# Altium project MU-RK3576J-MB.PrjPCB (part 1 of 13)
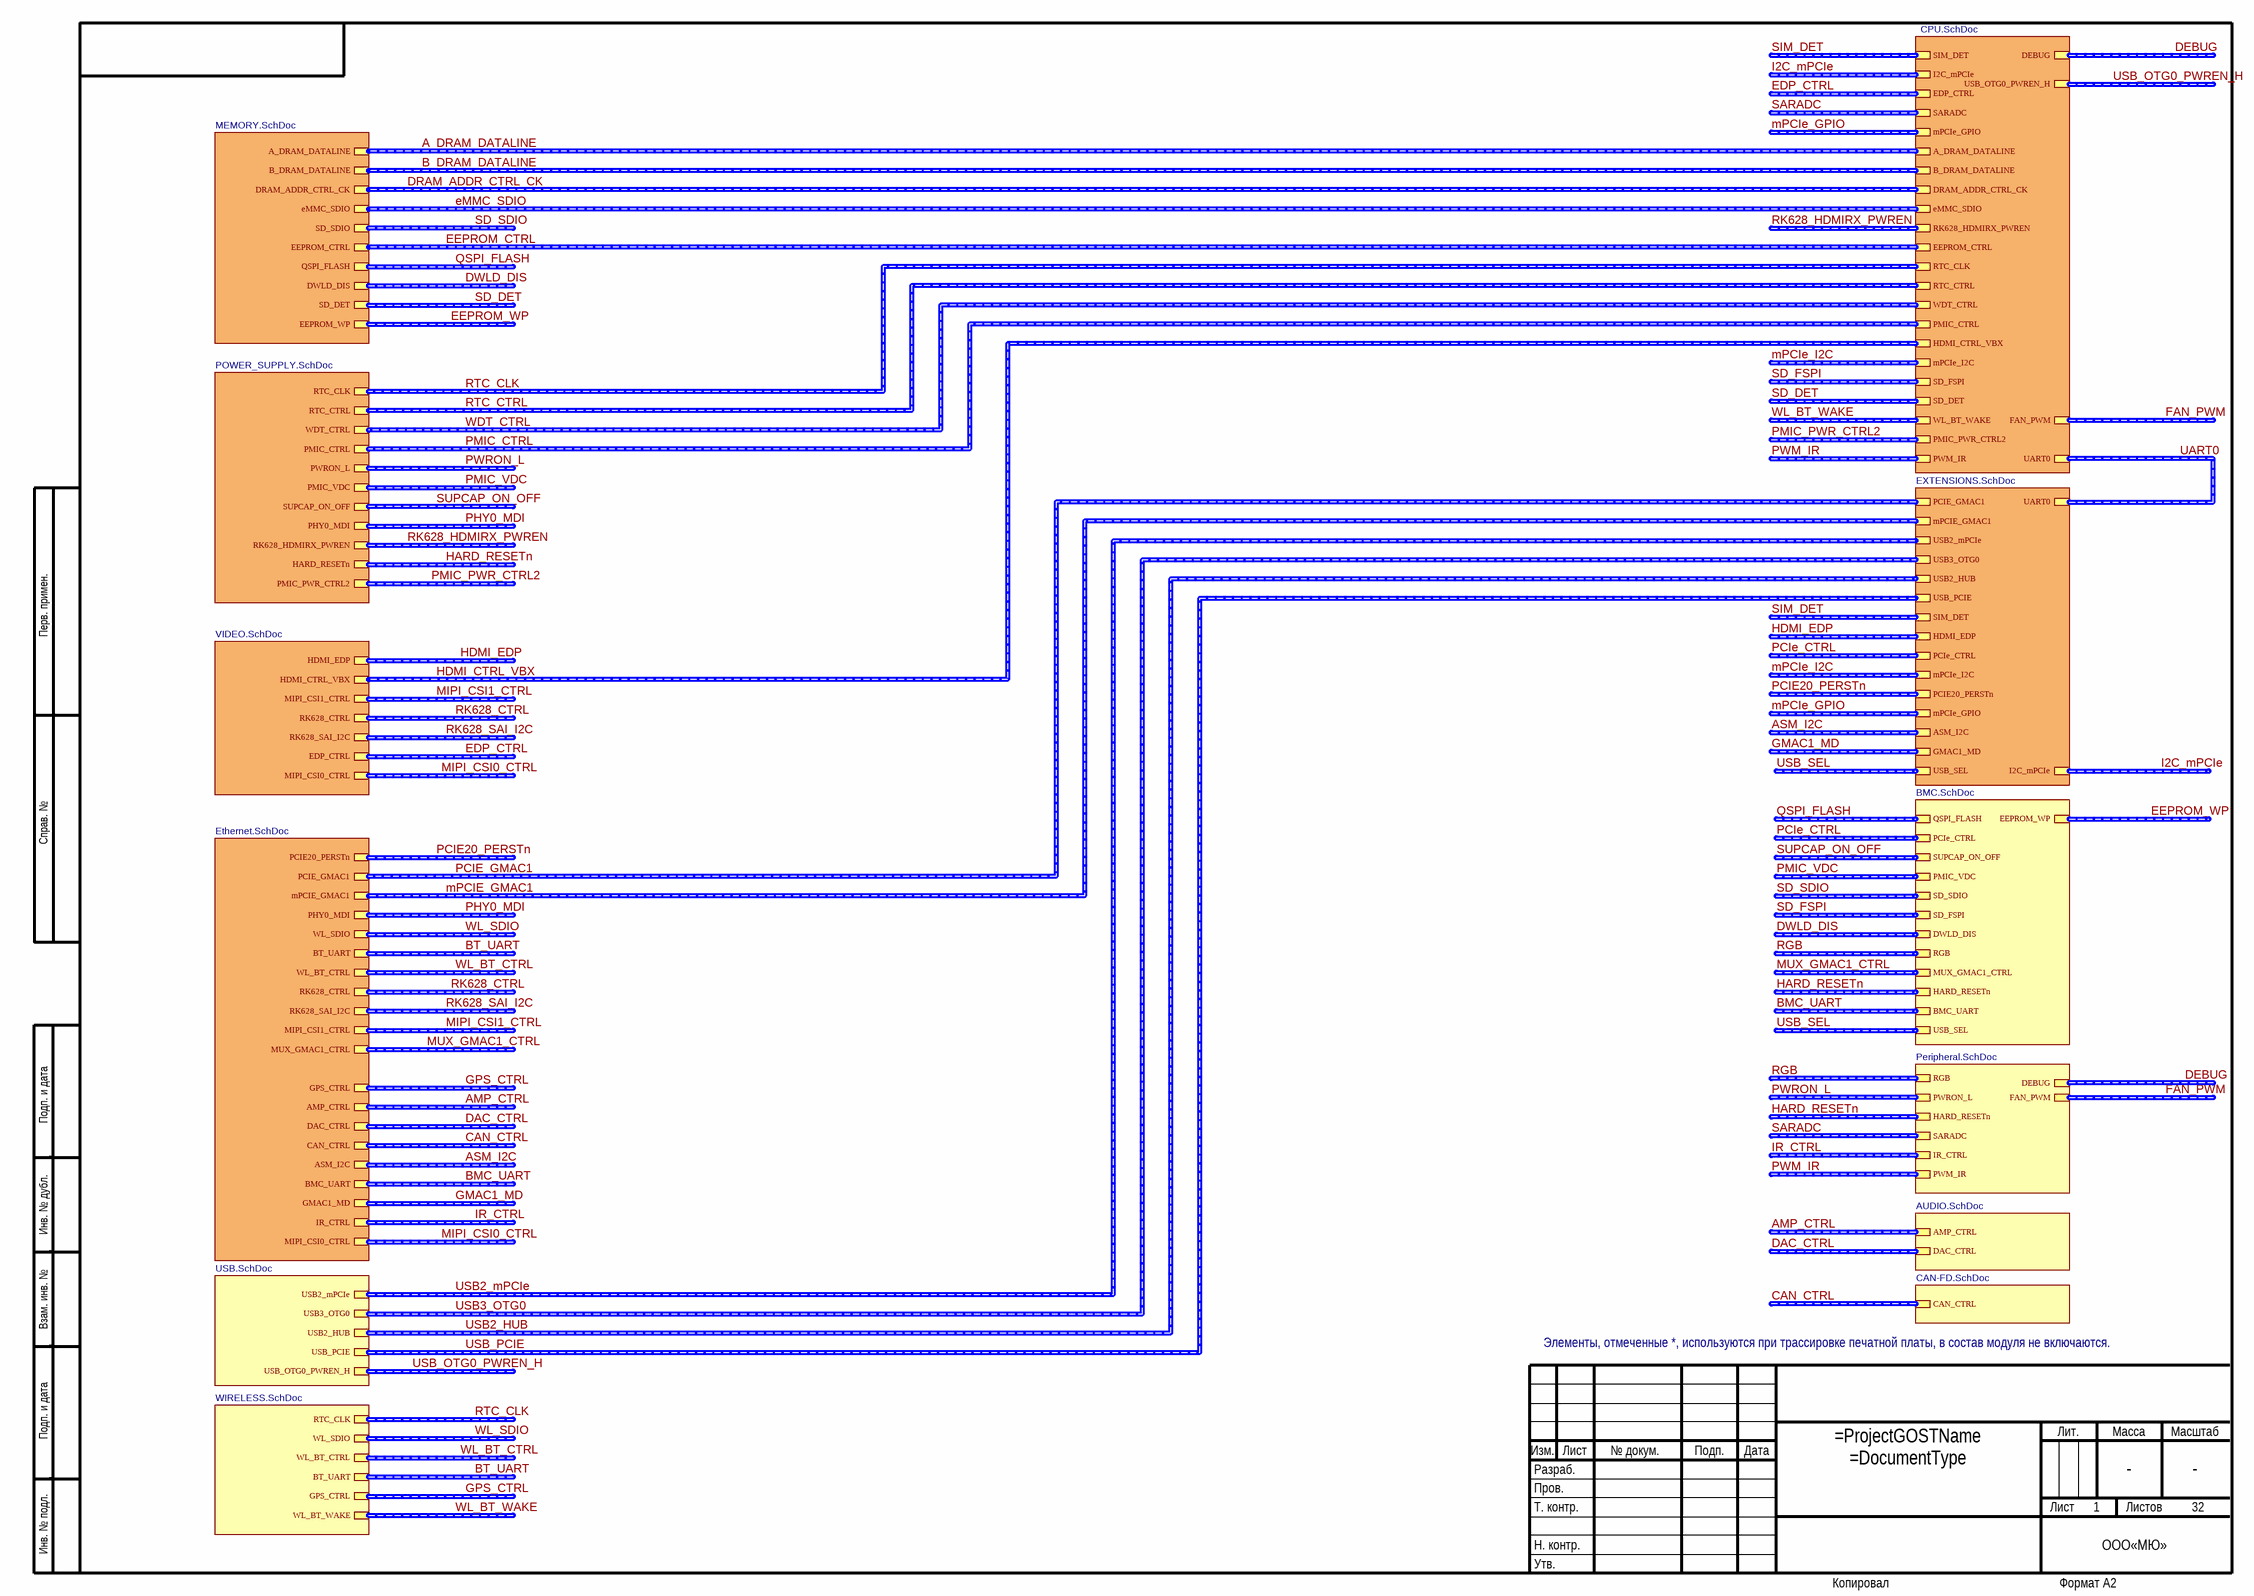
[diagram p0: Parent_sheet.SchDoc]
DecimalNumber: ЮРТН.466256.002; ProjectGOSTOrganization: «МЮ»; ProjectGOSTPCBName: Модуль процесорный; ProjectGOSTPCBNumber: АНПБ.687263.002; ProjectGOSTPCBWeight: 15 г; ProjectRevisionCode: C2D1; Вид_документа: Файл проекта печатной платы; Вид_документа_PCB: Файл печатной платы; Вид_документа_SCH: Схема электрическая принципиальная; Децимальный номер печатного узла: ЮРТН.466256.002; Код_документа_SCH: Э3; Код типа схемы: Э3; Наименование: Модуль процессорный; Наименование1: MU-RK3576J-MB; Наименование_PCB: Плата печатная; Обозначение: ЮРТН.466256.002; Обозначение_Код: ЮРТН.466256.002; Папка для сохранения графической документации: Документация; Папка для сохранения текстовой документации: Документация; Проект: ЮРТН.466256.002; Раздел: Документация; Раздел_PCB: Документация; Раздел_SCH: Документация; Разработал: SGDG; Тип документа: Схема электрическая принципиальная; Формат_PCB: А3
32 sheets, 1305 parts. Net scope: hierarchical (ports join the sheet entries above them; power ports are global).
Board file: MU-RK3576J-MB.PcbDoc
Sheets:
  Parent_sheet.SchDoc
    POWER_SUPPLY = POWER_SUPPLY.SchDoc
      PWR_DC_IN = PWR_DC_IN.SchDoc
      PWR_MAIN = PWR_MAIN.SchDoc
      PWR_PMIC = PWR_PMIC.SchDoc
      PWR_CPU = PWR_CPU.SchDoc
      PWR_PoE_PD_1000BASE-T = PWR_PoE_PD_1000BASE-T.SchDoc
      PWR_CORE = PWR_CORE.SchDoc
    CPU = CPU.SchDoc
      CPU_LPDDR4 = CPU_LPDDR4.SchDoc
      CPU_GPIO = CPU_GPIO.SchDoc
    MEMORY = MEMORY.SchDoc
      IC_LPDDR4 = IC_LPDDR4.SchDoc
      Flash_eMMC_MicroSD = Flash_eMMC_MicroSD.SchDoc
    VIDEO = VIDEO.SchDoc
      HDMI = HDMI.SchDoc
      CPU_MIPI_DSI_CSI = CPU_MIPI_DSI_CSI.SchDoc
      V-by-One.Sch = V-by-One.SchDoc
      LVDS_eDP = LVDS_eDP.SchDoc
      MIPI_x2CSI = MIPI_x2CSI.SchDoc
    EXTENSIONS = EXTENSIONS.SchDoc
      INT_mPCIeX2_SIM = INT_mPCIeX2_SIM.SchDoc
      CPU_PCIE_USB_HDMI_EXT_PCIEX2_mPCIeX2 = CPU_PCIE_USB_HDMI_EXT_PCIEX2_mPCIeX2.SchDoc
    USB = USB.SchDoc
    AUDIO = AUDIO.SchDoc
    BMC = BMC.SchDoc
    WIRELESS = WIRELESS.SchDoc
    Ethernet = Ethernet.SchDoc
      RGMII0_ETH_PHY = RGMII0_ETH_PHY.SchDoc
      CPU_ETH_RGMII1_SW = CPU_ETH_RGMII1_SW.SchDoc
    Peripheral = Peripheral.SchDoc
    CAN-FD = CAN-FD.SchDoc

## Sheet Parent_sheet.SchDoc
size 594 x 420 mm; SheetNumber: 1; SheetTotal: 32; Scale: -; DocumentType: Схема электрическая принципиальная; DocumentGOSTLIt1: ㅤ; DocumentGOSTLIt2: ㅤ; DocumentGOSTLIt3: ㅤ; DocumentGOSTNote: Элементы, отмеченные *, используются при трассировке печатной платы, в состав модуля не включаются.; DocumentTypeShort: Э3; DocumentInvertoryNumber: ㅤ

### Sub-sheets
AUDIO = AUDIO.SchDoc: AMP_CTRL (harness AMP_CTRL), DAC_CTRL (harness DAC_CTRL)
BMC = BMC.SchDoc: QSPI_FLASH (harness QSPI_FLASH), PCIe_CTRL (harness PCIe_CTRL), SUPCAP_ON_OFF (harness SUPCAP_ON_OFF), PMIC_VDC (harness PMIC_VDC), SD_SDIO (harness SD_SDIO), SD_FSPI (harness SD_FSPI), DWLD_DIS (harness DWLD_DIS), RGB (harness RGB), MUX_GMAC1_CTRL (harness MUX_GMAC1_CTRL), HARD_RESETn (harness HARD_RESETn), BMC_UART (harness BMC_UART), USB_SEL (harness USB_SEL), EEPROM_WP (harness EEPROM_WP)
CAN-FD = CAN-FD.SchDoc: CAN_CTRL (harness CAN_CTRL)
CPU = CPU.SchDoc: A_DRAM_DATALINE, B_DRAM_DATALINE, DRAM_ADDR_CTRL_CK, HDMI_CTRL_VBX, WDT_CTRL, RTC_CLK, RTC_CTRL, eMMC_SDIO, PMIC_CTRL, EEPROM_CTRL, SD_FSPI, SD_DET, WL_BT_WAKE, EDP_CTRL, SARADC, mPCIe_GPIO, RK628_HDMIRX_PWREN, SIM_DET, mPCIe_I2C, PMIC_PWR_CTRL2, PWM_IR, I2C_mPCIe, DEBUG, UART0, FAN_PWM, USB_OTG0_PWREN_H
Ethernet = Ethernet.SchDoc: PCIE_GMAC1, mPCIE_GMAC1, PHY0_MDI, WL_SDIO, BT_UART, WL_BT_CTRL, RK628_SAI_I2C, MIPI_CSI1_CTRL, MUX_GMAC1_CTRL, RK628_CTRL, GPS_CTRL, AMP_CTRL, DAC_CTRL, CAN_CTRL, ASM_I2C, BMC_UART, GMAC1_MD, PCIE20_PERSTn, IR_CTRL, MIPI_CSI0_CTRL
EXTENSIONS = EXTENSIONS.SchDoc: mPCIe_GPIO, SIM_DET, mPCIe_I2C, PCIE_GMAC1, mPCIE_GMAC1, USB3_OTG0, USB2_HUB, USB_PCIE, PCIe_CTRL, USB2_mPCIe, HDMI_EDP, ASM_I2C, GMAC1_MD, PCIE20_PERSTn, USB_SEL, I2C_mPCIe, UART0
MEMORY = MEMORY.SchDoc: A_DRAM_DATALINE, B_DRAM_DATALINE, DRAM_ADDR_CTRL_CK, eMMC_SDIO, SD_SDIO, EEPROM_CTRL, DWLD_DIS, SD_DET, QSPI_FLASH, EEPROM_WP
Peripheral = Peripheral.SchDoc: RGB (harness RGB), PWRON_L (harness PWRON_L), SARADC (harness SARADC), HARD_RESETn (harness HARD_RESETn), IR_CTRL (harness IR_CTRL), PWM_IR (harness PWM0_IR), DEBUG (harness DEBUG), FAN_PWM (harness FAN_PWM)
POWER_SUPPLY = POWER_SUPPLY.SchDoc: SUPCAP_ON_OFF, RTC_CLK, RTC_CTRL, WDT_CTRL, PHY0_MDI, PMIC_CTRL, PWRON_L, PMIC_VDC, HARD_RESETn, PMIC_PWR_CTRL2, RK628_HDMIRX_PWREN
USB = USB.SchDoc: USB2_mPCIe (harness USB2_mPCIe), USB3_OTG0 (harness USB3_OTG0), USB2_HUB (harness USB2_HUB), USB_PCIE (harness USB_PCIE), USB_OTG0_PWREN_H (harness USB_OTG0_PWREN_H)
VIDEO = VIDEO.SchDoc: HDMI_CTRL_VBX, MIPI_CSI1_CTRL, HDMI_EDP, RK628_SAI_I2C, EDP_CTRL, RK628_CTRL, MIPI_CSI0_CTRL
WIRELESS = WIRELESS.SchDoc: WL_SDIO (harness WL_SDIO), WL_BT_CTRL (harness WL_BT_CTRL), RTC_CLK (harness RTC_CLK), BT_UART (harness BT_UART), GPS_CTRL (harness GPS_CTRL), WL_BT_WAKE (harness WL_BT_WAKE)

### Buses and harness runs
harness A_DRAM_DATALINE = sheet CPU/A_DRAM_DATALINE = sheet MEMORY/A_DRAM_DATALINE
harness AMP_CTRL = sheet AUDIO/AMP_CTRL
harness AMP_CTRL = sheet Ethernet/AMP_CTRL
harness ASM_I2C = sheet Ethernet/ASM_I2C
harness ASM_I2C = sheet EXTENSIONS/ASM_I2C
harness B_DRAM_DATALINE = sheet CPU/B_DRAM_DATALINE = sheet MEMORY/B_DRAM_DATALINE
harness BMC_UART = sheet BMC/BMC_UART
harness BMC_UART = sheet Ethernet/BMC_UART
harness BT_UART = sheet Ethernet/BT_UART
harness BT_UART = sheet WIRELESS/BT_UART
harness CAN_CTRL = sheet CAN-FD/CAN_CTRL
harness CAN_CTRL = sheet Ethernet/CAN_CTRL
harness DAC_CTRL = sheet AUDIO/DAC_CTRL
harness DAC_CTRL = sheet Ethernet/DAC_CTRL
harness DEBUG = sheet CPU/DEBUG
harness DEBUG = sheet Peripheral/DEBUG
harness DRAM_ADDR_CTRL_CK = sheet CPU/DRAM_ADDR_CTRL_CK = sheet MEMORY/DRAM_ADDR_CTRL_CK
harness DWLD_DIS = sheet BMC/DWLD_DIS
harness DWLD_DIS = sheet MEMORY/DWLD_DIS
harness EDP_CTRL = sheet CPU/EDP_CTRL
harness EDP_CTRL = sheet VIDEO/EDP_CTRL
harness EEPROM_CTRL = sheet CPU/EEPROM_CTRL = sheet MEMORY/EEPROM_CTRL
harness EEPROM_WP = sheet BMC/EEPROM_WP
harness EEPROM_WP = sheet MEMORY/EEPROM_WP
harness eMMC_SDIO = sheet CPU/eMMC_SDIO = sheet MEMORY/eMMC_SDIO
harness FAN_PWM = sheet CPU/FAN_PWM
harness FAN_PWM = sheet Peripheral/FAN_PWM
harness GMAC1_MD = sheet Ethernet/GMAC1_MD
harness GMAC1_MD = sheet EXTENSIONS/GMAC1_MD
harness GPS_CTRL = sheet Ethernet/GPS_CTRL
harness GPS_CTRL = sheet WIRELESS/GPS_CTRL
harness HARD_RESETn = sheet BMC/HARD_RESETn
harness HARD_RESETn = sheet Peripheral/HARD_RESETn
harness HARD_RESETn = sheet POWER_SUPPLY/HARD_RESETn
harness HDMI_CTRL_VBX = sheet CPU/HDMI_CTRL_VBX = sheet VIDEO/HDMI_CTRL_VBX
harness HDMI_EDP = sheet EXTENSIONS/HDMI_EDP
harness HDMI_EDP = sheet VIDEO/HDMI_EDP
harness I2C_mPCIe = sheet CPU/I2C_mPCIe
harness I2C_mPCIe = sheet EXTENSIONS/I2C_mPCIe
harness IR_CTRL = sheet Ethernet/IR_CTRL
harness IR_CTRL = sheet Peripheral/IR_CTRL
harness MIPI_CSI0_CTRL = sheet Ethernet/MIPI_CSI0_CTRL
harness MIPI_CSI0_CTRL = sheet VIDEO/MIPI_CSI0_CTRL
harness MIPI_CSI1_CTRL = sheet Ethernet/MIPI_CSI1_CTRL
harness MIPI_CSI1_CTRL = sheet VIDEO/MIPI_CSI1_CTRL
harness mPCIE_GMAC1 = sheet Ethernet/mPCIE_GMAC1 = sheet EXTENSIONS/mPCIE_GMAC1
harness mPCIe_GPIO = sheet CPU/mPCIe_GPIO
harness mPCIe_GPIO = sheet EXTENSIONS/mPCIe_GPIO
harness mPCIe_I2C = sheet CPU/mPCIe_I2C
harness mPCIe_I2C = sheet EXTENSIONS/mPCIe_I2C
harness MUX_GMAC1_CTRL = sheet BMC/MUX_GMAC1_CTRL
harness MUX_GMAC1_CTRL = sheet Ethernet/MUX_GMAC1_CTRL
harness PCIE20_PERSTn = sheet Ethernet/PCIE20_PERSTn
harness PCIE20_PERSTn = sheet EXTENSIONS/PCIE20_PERSTn
harness PCIe_CTRL = sheet BMC/PCIe_CTRL
harness PCIe_CTRL = sheet EXTENSIONS/PCIe_CTRL
harness PCIE_GMAC1 = sheet Ethernet/PCIE_GMAC1 = sheet EXTENSIONS/PCIE_GMAC1
harness PHY0_MDI = sheet Ethernet/PHY0_MDI
harness PHY0_MDI = sheet POWER_SUPPLY/PHY0_MDI
harness PMIC_CTRL = sheet CPU/PMIC_CTRL = sheet POWER_SUPPLY/PMIC_CTRL
harness PMIC_PWR_CTRL2 = sheet CPU/PMIC_PWR_CTRL2
harness PMIC_PWR_CTRL2 = sheet POWER_SUPPLY/PMIC_PWR_CTRL2
harness PMIC_VDC = sheet BMC/PMIC_VDC
harness PMIC_VDC = sheet POWER_SUPPLY/PMIC_VDC
harness PWM_IR = sheet CPU/PWM_IR
harness PWM_IR = sheet Peripheral/PWM_IR
harness PWRON_L = sheet Peripheral/PWRON_L
harness PWRON_L = sheet POWER_SUPPLY/PWRON_L
harness QSPI_FLASH = sheet BMC/QSPI_FLASH
harness QSPI_FLASH = sheet MEMORY/QSPI_FLASH
harness RGB = sheet BMC/RGB
harness RGB = sheet Peripheral/RGB
harness RK628_CTRL = sheet Ethernet/RK628_CTRL
harness RK628_CTRL = sheet VIDEO/RK628_CTRL
harness RK628_HDMIRX_PWREN = sheet CPU/RK628_HDMIRX_PWREN
harness RK628_HDMIRX_PWREN = sheet POWER_SUPPLY/RK628_HDMIRX_PWREN
harness RK628_SAI_I2C = sheet Ethernet/RK628_SAI_I2C
harness RK628_SAI_I2C = sheet VIDEO/RK628_SAI_I2C
harness RTC_CLK = sheet CPU/RTC_CLK = sheet POWER_SUPPLY/RTC_CLK
harness RTC_CLK = sheet WIRELESS/RTC_CLK
harness RTC_CTRL = sheet CPU/RTC_CTRL = sheet POWER_SUPPLY/RTC_CTRL
harness SARADC = sheet CPU/SARADC
harness SARADC = sheet Peripheral/SARADC
harness SD_DET = sheet CPU/SD_DET
harness SD_DET = sheet MEMORY/SD_DET
harness SD_FSPI = sheet BMC/SD_FSPI
harness SD_FSPI = sheet CPU/SD_FSPI
harness SD_SDIO = sheet BMC/SD_SDIO
harness SD_SDIO = sheet MEMORY/SD_SDIO
harness SIM_DET = sheet CPU/SIM_DET
harness SIM_DET = sheet EXTENSIONS/SIM_DET
harness SUPCAP_ON_OFF = sheet BMC/SUPCAP_ON_OFF
harness SUPCAP_ON_OFF = sheet POWER_SUPPLY/SUPCAP_ON_OFF
harness UART0 = sheet CPU/UART0 = sheet EXTENSIONS/UART0
harness USB2_HUB = sheet EXTENSIONS/USB2_HUB = sheet USB/USB2_HUB
harness USB2_mPCIe = sheet EXTENSIONS/USB2_mPCIe = sheet USB/USB2_mPCIe
harness USB3_OTG0 = sheet EXTENSIONS/USB3_OTG0 = sheet USB/USB3_OTG0
harness USB_OTG0_PWREN_H = sheet CPU/USB_OTG0_PWREN_H
harness USB_OTG0_PWREN_H = sheet USB/USB_OTG0_PWREN_H
harness USB_PCIE = sheet EXTENSIONS/USB_PCIE = sheet USB/USB_PCIE
harness USB_SEL = sheet BMC/USB_SEL
harness USB_SEL = sheet EXTENSIONS/USB_SEL
harness WDT_CTRL = sheet CPU/WDT_CTRL = sheet POWER_SUPPLY/WDT_CTRL
harness WL_BT_CTRL = sheet Ethernet/WL_BT_CTRL
harness WL_BT_CTRL = sheet WIRELESS/WL_BT_CTRL
harness WL_BT_WAKE = sheet CPU/WL_BT_WAKE
harness WL_BT_WAKE = sheet WIRELESS/WL_BT_WAKE
harness WL_SDIO = sheet Ethernet/WL_SDIO
harness WL_SDIO = sheet WIRELESS/WL_SDIO

### Notes on the sheet
- Перв. примен.
- Справ. №
- Подп. и дата
- Инв. № дубл.
- Взам. инв. №
- Разраб.
- Изм.
- Лист
- № докум.
- Подп.
- Дата
- Лит.
- Масса
- Масштаб
- Пров.
- Т. контр.
- -
- Листов
- Инв. № подл.
- Утв.
- Н. контр.
- Копировал
- Формат А2

## Sheet POWER_SUPPLY.SchDoc
size 420 x 297 mm; SheetNumber: 2; SheetTotal: 32; DocumentTypeShort: Э3; DocumentInvertoryNumber: ㅤ
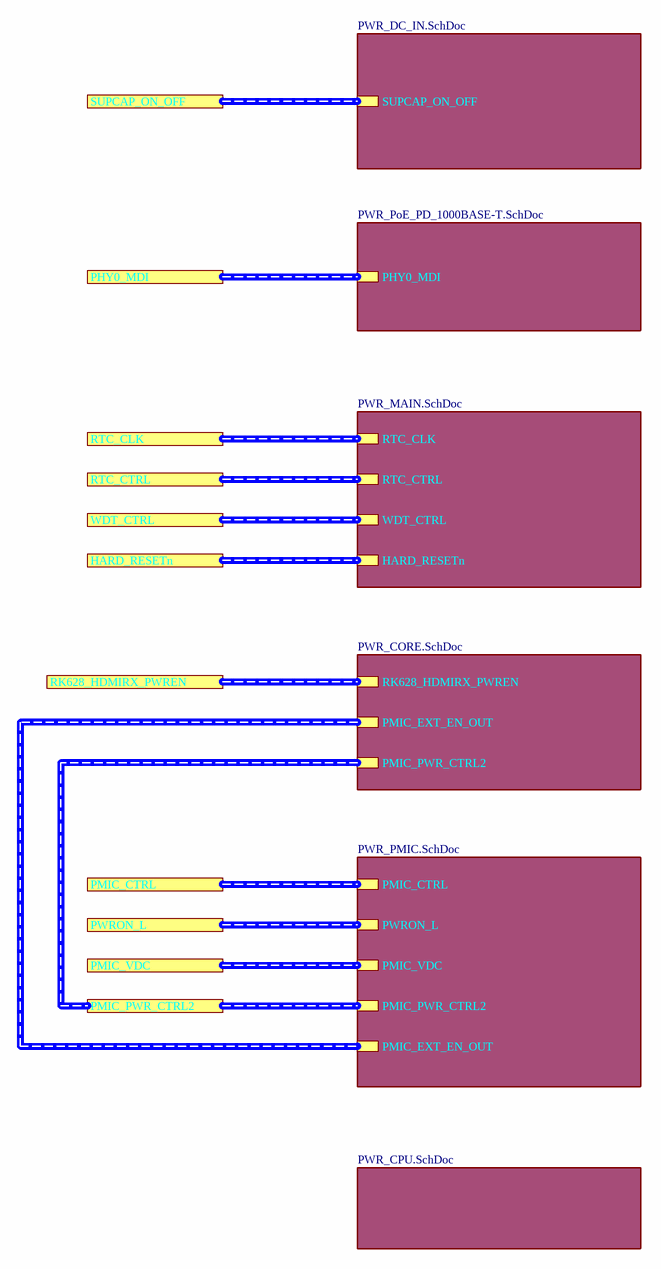
[diagram p1: POWER_SUPPLY.SchDoc]

### Sub-sheets
PWR_CORE = PWR_CORE.SchDoc: PMIC_PWR_CTRL2 (harness CORE_CTRL), PMIC_EXT_EN_OUT (harness CORE_CTRL), RK628_HDMIRX_PWREN (harness CORE_CTRL)
PWR_CPU = PWR_CPU.SchDoc: no entries
PWR_DC_IN = PWR_DC_IN.SchDoc: SUPCAP_ON_OFF (harness SUPCAP_ON_OFF)
PWR_MAIN = PWR_MAIN.SchDoc: RTC_CLK (harness RTC_CLK), RTC_CTRL (harness RTC_CTRL), WDT_CTRL (harness WDT_CTRL), HARD_RESETn (harness RTC_CLK)
PWR_PMIC = PWR_PMIC.SchDoc: PMIC_CTRL (harness PMIC_CTRL), PWRON_L (harness PWRON_L), PMIC_VDC (harness PMIC_VDC), PMIC_PWR_CTRL2 (harness CORE_CTRL), PMIC_EXT_EN_OUT (harness CORE_CTRL)
PWR_PoE_PD_1000BASE-T = PWR_PoE_PD_1000BASE-T.SchDoc: PHY0_MDI (harness PHY0_MDI)

### Ports
HARD_RESETn, PHY0_MDI, PMIC_CTRL, PMIC_PWR_CTRL2, PMIC_VDC, PWRON_L, RK628_HDMIRX_PWREN, RTC_CLK, RTC_CTRL, SUPCAP_ON_OFF, WDT_CTRL

### Buses and harness runs
harness port HARD_RESETn = sheet PWR_MAIN/HARD_RESETn
harness port PHY0_MDI = sheet PWR_PoE_PD_1000BASE-T/PHY0_MDI
harness port PMIC_CTRL = sheet PWR_PMIC/PMIC_CTRL
harness port PMIC_PWR_CTRL2 = sheet PWR_CORE/PMIC_PWR_CTRL2 = sheet PWR_PMIC/PMIC_PWR_CTRL2
harness port PMIC_VDC = sheet PWR_PMIC/PMIC_VDC
harness port PWRON_L = sheet PWR_PMIC/PWRON_L
harness port RK628_HDMIRX_PWREN = sheet PWR_CORE/RK628_HDMIRX_PWREN
harness port RTC_CLK = sheet PWR_MAIN/RTC_CLK
harness port RTC_CTRL = sheet PWR_MAIN/RTC_CTRL
harness port SUPCAP_ON_OFF = sheet PWR_DC_IN/SUPCAP_ON_OFF
harness port WDT_CTRL = sheet PWR_MAIN/WDT_CTRL
harness sheet PWR_CORE/PMIC_EXT_EN_OUT = sheet PWR_PMIC/PMIC_EXT_EN_OUT

### Notes on the sheet
- Подп. и дата
- Инв. № дубл.
- Взам. инв. №
- Инв. № подл.
- Изм.
- Лист
- № докум.
- Подп.
- Дата
- Копировал
- Формат А3

## Sheet PWR_DC_IN.SchDoc
size 420 x 297 mm; Scale: 1:1; DocumentType: Схема электрическая принципиальная; SheetNumber: 3; SheetTotal: 32; DocumentTypeShort: Э3; DocumentInvertoryNumber: ㅤ
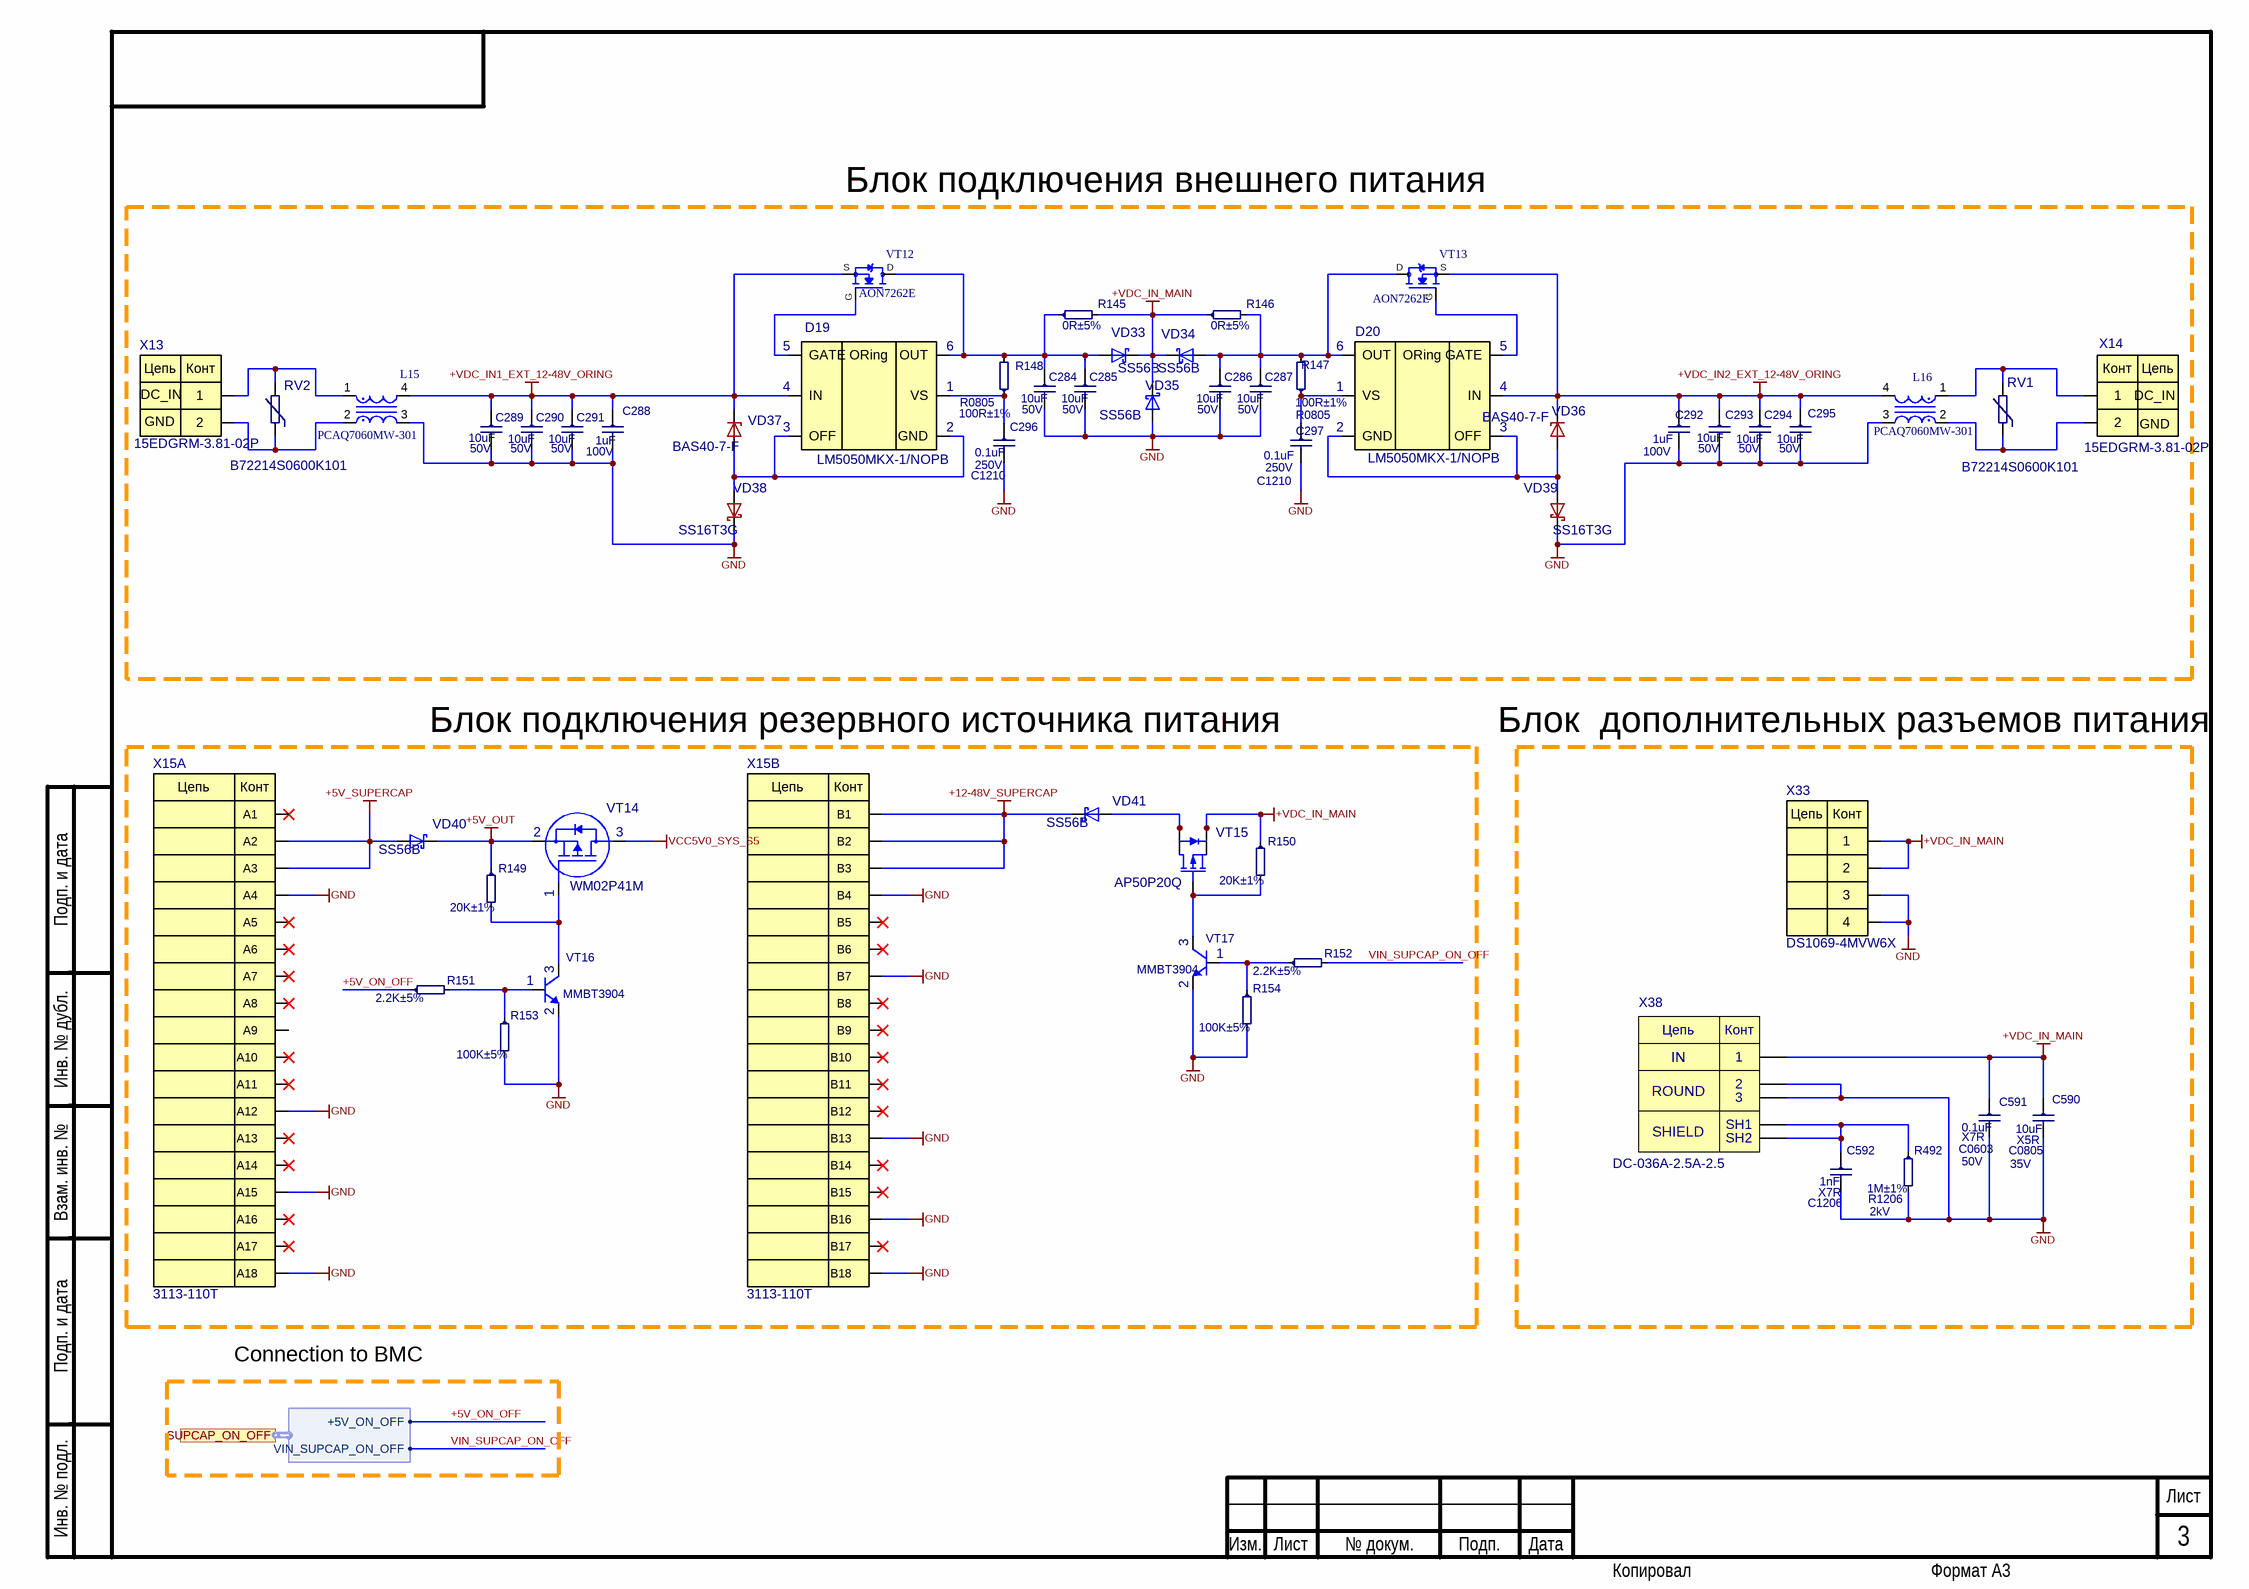
[diagram p2: PWR_DC_IN.SchDoc]

### Parts
C284  10uF  Voltage: 50V  [C1206]
C285  10uF  Voltage: 50V  [C1206]
C286  10uF  Voltage: 50V  [C1206]
C287  10uF  Voltage: 50V  [C1206]
C288  1uF  Voltage: 100V  [C1206]
C289  10uF  Voltage: 50V  [C1206]
C290  10uF  Voltage: 50V  [C1206]
C291  10uF  Voltage: 50V  [C1206]
C292  1uF  Voltage: 100V  [C1206]
C293  10uF  Voltage: 50V  [C1206]
C294  10uF  Voltage: 50V  [C1206]
C295  10uF  Voltage: 50V  [C1206]
C296  0.1uF  Voltage: 250V  [C1210]
C297  0.1uF  Voltage: 250V  [C1210]
C590  10uF  Dielectric: X5R  Voltage: 35V  [C0805]
C591  0.1uF  Dielectric: X7R  Voltage: 50V  [C0603]
C592  1nF  Dielectric: X7R  Voltage: 2kV  [C1206]
D19  LM5050MKX-1/NOPB  [LM5050MKX-1/NOPB]
D20  LM5050MKX-1/NOPB  [LM5050MKX-1/NOPB]
L15  PCAQ7060MW-301  [PCAQ7060MW-301]
L16  PCAQ7060MW-301  [PCAQ7060MW-301]
R145  0R±5%  [R2010]
R146  0R±5%  [R2010]
R147  100R±1%  [R0805]
R148  100R±1%  [R0805]
R149  20K±1%  [R0402]
R150  20K±1%  [R0402]
R151  2.2K±5%  [R0402]
R152  2.2K±5%  [R0402]
R153  100K±5%  [R0402]
R154  100K±5%  [R0402]
R492  1M±1%  [R1206]
RV1  B72214S0600K101  [Var_dia15.5]
RV2  B72214S0600K101  [Var_dia15.5]
VD33  SS56B  [DO-214AA]
VD34  SS56B  [DO-214AA]
VD35  SS56B  [DO-214AA]
VD36  BAS40-7-F  [SOT23]
VD37  BAS40-7-F  [SOT23]
VD38  SS16T3G  [DO-214AC]
VD39  SS16T3G  [DO-214AC]
VD40  SS56B  [DO-214AA]
VD41  SS56B  [DO-214AA]
VT12  AON7262E  [AON7262E]
VT13  AON7262E  [AON7262E]
VT14  WM02P41M  [SOT23]
VT15  AP50P20Q  [AP50P20Q]
VT16  MMBT3904  [SOT23]
VT17  MMBT3904  [SOT23]
X13  15EDGRM-3.81-02P  [15EDGRM-3.81-02P]
X14  15EDGRM-3.81-02P  [15EDGRM-3.81-02P]
X15  3113-110T  [3113-110T]  (parts A,B of 2)
X33  DS1069-4MVW6X  [DS1069-4MVW6X]
X38  DC-036A-2.5A-2.5  [DC-036A-2.5A-2.5]

### Ports
SUPCAP_ON_OFF (harness SUPCAP_ON_OFF)

### Harnesses
SUPCAP_ON_OFF: +5V_ON_OFF, VIN_SUPCAP_ON_OFF

### Nets
+5V_OUT: R149.1 VD40.1(K) VT14.2
+5V_SUPERCAP: VD40.2(A) X15.A2 X15.A3
+12-48V_SUPERCAP: VD41.1(K) X15.B1 X15.B2 X15.B3
+VDC_IN1_EXT_12-48V_ORING: C288.1 C289.1 C290.1 C291.1 D19.4(IN) L15.4 VD37.1(C) VT12.S
+VDC_IN2_EXT_12-48V_ORING: C292.1 C293.1 C294.1 C295.1 D20.4(IN) L16.4 VD36.1(C) VT13.S
+VDC_IN_MAIN: C590.1 C591.1 R145.2 R146.1 R150.1 VD33.1(K) VD34.1(K) VD35.1(K) VT15.1 VT15.2 VT15.3 X33.1 X33.2 X38.1(IN)
GND: C284.2 C285.2 C286.2 C287.2 C288.2 C289.2 C290.2 C291.2 C292.2 C293.2 C294.2 C295.2 C296.2 C297.2 C590.2 C591.2 C592.2 L15.3 L16.3 R153.2 R154.2 R492.2 VD35.2(A) VD38.1(C) VD39.1(C) VT16.2(E) VT17.2(E) X15.A4 X15.A12 X15.A15 X15.A18 X15.B4 X15.B7 X15.B13 X15.B16 X15.B18 X33.3 X33.4 X38.2(ROUND) X38.3(ROUND)
VCC5V0_SYS_S5: VT14.3
+5V_ON_OFF: R151.1 ; port SUPCAP_ON_OFF.+5V_ON_OFF
VIN_SUPCAP_ON_OFF: R152.2 ; port SUPCAP_ON_OFF.VIN_SUPCAP_ON_OFF  [project net SUPCAP_ON_OFF.VIN_SUPCAP_ON_OFF]
NetC284_1: C284.1 C285.1 D19.6(OUT) R145.1 R148.2 VD33.2(A) VT12.D
NetC286_1: C286.1 C287.1 D20.6(OUT) R146.2 R147.2 VD34.2(A) VT13.D
NetC296_1: C296.1 D19.1(VS) R148.1
NetC297_1: C297.1 D20.1(VS) R147.1
NetC592_1: C592.1 R492.1 X38.SH1 X38.SH2
NetD19_2: D19.2(GND) D19.3(OFF) VD37.2(A) VD38.2(A)
NetD19_5: D19.5(GATE) VT12.G
NetD20_2: D20.2(GND) D20.3(OFF) VD36.2(A) VD39.2(A)
NetD20_5: D20.5(GATE) VT13.G
NetL15_1: L15.1 RV2.2 X13.1
NetL15_2: L15.2 RV2.1 X13.2
NetL16_1: L16.1 RV1.2 X14.1
NetL16_2: L16.2 RV1.1 X14.2
NetR149_2: R149.2 VT14.1 VT16.3(C)
NetR150_2: R150.2 VT15.4 VT17.3(C)
NetR151_2: R151.2 R153.1 VT16.1(B)
NetR152_1: R152.1 R154.1 VT17.1(B)
NetVD41_2: VD41.2(A) VT15.5 VT15.6 VT15.7 VT15.8

Not connected (* = marked no-connect by the designer): X15 A1* A5* A6* A7* A8* A9 A10* A11* A13* A14* A16* A17* B5* B6* B8* B9* B10* B11* B12* B14* B15* B17*

### Notes on the sheet
- Блок подключения внешнего питания
- (near X13) DC_IN
- (near X14) DC_IN
- (near X13) GND
- (near X14) GND
- Блок подключения резервного источника питания
- Блок  дополнительных разъемов питания
- Connection to BMC
- Подп. и дата
- Инв. № дубл.
- Взам. инв. №
- Инв. № подл.
- Изм.
- Лист
- № докум.
- Подп.
- Дата
- Копировал
- Формат А3
- (in symbol 15EDGRM-3.81-02P) Цепь; Конт
- (in symbol 3113-110T, part A) Цепь; Конт
- (in symbol 3113-110T, part B) Цепь; Конт
- (in symbol DC-036A-2.5A-2.5) Цепь; Конт; SHIELD
- (in symbol DS1069-4MVW6X) Цепь; Конт
- (in symbol LM5050MKX-1/NOPB) ORing

### Library data of the parts
C284-C287 C289-C291 C293-C295 = 1206-X5R-50V-010uF±10%: Manufacturer: Yageo; NameFromManufacturer: CC1206KKX5R9BB106; Dielectric: X5R; Place: *); Tolerance: 10%; Check: False; Case: C1206; Part Number: 1206-X5R-50V-010uF±10%; Value: 10uF; Temperature: -55°C~85°C; ComponentLink2Description: Link to datasheet; ComponentLink1Description: DATASHEET; ComponentLink2URL: https://www.terraelectronica.ru/product/2097656; ComponentLink1URL: Datasheets/capacitors/UPY-GPHC_X5R_4V-to-50V_27.pdf; Last changed: 27.10.2022
C288 C292 = 1206-X7R-100V-1uF±10%: Manufacturer: CCTC; NameFromManufacturer: TCC1206X7R105K101HT; Dielectric: X7R; Place: *); Tolerance: 10%; Check: False; Case: C1206; Part Number: 1206-X7R-100V-1uF±10%; Value: 1uF; Temperature: -55°C~125°C; ComponentLink2Description: Link to datasheet; ComponentLink1Description: DATASHEET; ComponentLink2URL: https://www.digikey.com/en/products/detail/kemet/C1206C105K1RAC7800/5119820; ComponentLink1URL: Datasheets/capacitors/C1206C105K1RACTU.pdf; Last changed: 27.10.2022
C296 C297 = 1210-X7R-250V-0.1uF±10%: Manufacturer: Yageo; NameFromManufacturer: CC1210KKX7RYBB104; Dielectric: X7R; Place: *); Tolerance: 10%; Check: False; Case: C1210; Part Number: 1210-X7R-250V-0.1uF±10%; Value: 0.1uF; Temperature: -55°C~125°C; ComponentLink2Description: Link to datasheet; ComponentLink1Description: DATASHEET; ComponentLink2URL: https://www.electronshik.ru/item/YAG/CC1210KKX7RYBB104; ComponentLink1URL: Datasheets/capacitors/UPY-GPHC_X7R_6.3V-to-250V_22.pdf#Datasheets/capacitors/UPY-GPHC_X7R_6.3V-to-250V_22.pdf#; Last changed: 15.11.2022
C590 = 0805-X5R-35V-10uF±10%: *; Manufacturer: TDK Corporation; NameFromManufacturer: C2012X5R1V106K085AC; Place: *); Tolerance: 10%; Check: False; Case: C0805; Part Number: 0805-X5R-35V-10uF±10%; Value: 10uF; Temperature: -55°C~85°C; ComponentLink2Description: Link to datasheet; ComponentLink1Description: DATASHEET; ComponentLink2URL: https://ru.mouser.com/ProductDetail/TDK/C2012X5R1V106K085AC?qs=%2Fha2pyFadujDqt6GaOhNLapiXMVR473hecC3EhBEJAjxMNkR78ehMSD9s1oir4w0; ComponentLink1URL: Datasheets/capacitors/mlccspec_commercial_general_midvoltage_en.pdf; Last changed: 27.10.2022
C591 = 0603-X7R-50V-0.1uF±10%: Manufacturer: Yageo; NameFromManufacturer: CC0603KRX7R9BB104; Place: *); Tolerance: 10%; Check: False; Case: C0603; Part Number: 0603-X7R-50V-0.1uF±10%; Value: 0.1uF; Temperature: -55°C~125°C; ComponentLink2Description: Link to datasheet; ComponentLink1Description: DATASHEET; ComponentLink2URL: https://www.yageo.com/upload/media/product/productsearch/datasheet/mlcc/UPY-GPHC_X7R_6.3V-to-50V_18.pdf; ComponentLink1URL: Datasheets/capacitors/UPY-GPHC_X7R_6.3V-to-50V_18.pdf; Last changed: 27.10.2022
C592 = 1206-X7R-2K-1000pF±10%: Ceramic Capacitor 1206 1nF ±10% 2kV X7R; Manufacturer: Yageo; NameFromManufacturer: CC1206KKX7RDBB102; Place: *); Analog: 1206B102K202; Check: False; Case: C1206; Part Number: 1206-X7R-2K-1000pF±10%; Value: 1nF; Tolerance: 10%; Temperature: -55°C~125°C; ComponentLink2Description: Link to datasheet; ComponentLink1Description: DATASHEET; ComponentLink2URL: https://www.lcsc.com/product-detail/Multilayer-Ceramic-Capacitors-MLCC-SMD-SMT_YAGEO-CC1206KKX7RDBB102_C23631.html; Last changed: 09.04.2025
D19 D20 = LM5050MKX-1/NOPB: High-Side OR-ing FET Controller; Manufacturer: TI; Check: False; Part Number: LM5050MKX-1/NOPB; Value: LM5050MKX-1/NOPB; NameFromManufacturer: LM5050MKX-1/NOPB
L15 L16 = PCAQ7060MW-301: 300Ω@100MHz 10mΩ 2 SMD,7x6x3.8mm; Manufacturer: PROD Tech; MF: Panasonic Electronic; MP: EEH-ZA1V151P; Check: False; Availability: In Stock; Price: None; Package: RADIAL-2 Panasonic; SnapEDA_Link: https://www.snapeda.com/parts/EEH-ZA1V151P/Panasonic%20Electronic%20Components/view-part/2297820/?ref=snap; Value: PCAQ7060MW-301; Check_prices: https://www.snapeda.com/parts/EEH-ZA1V151P/Panasonic%20Electronic%20Components/view-part/2297820/?ref=eda; Purchase-URL: https://pricing.snapeda.com/search/part/EEH-ZA1V151P/?ref=eda; Part Number: PCAQ7060MW-301; NameFromManufacturer: PCAQ7060MW-301
R145 R146 = 2010-0.75W-0R-200ppm±5%: Chip Resistor 2010 0Ω ±5% 200V ±200ppm/℃ Thick Film; NameFromManufacturer: RC2010JK-070RL; Manufacturer: Yageo; Place: *); Value: 0R; Check: False; Case: R2010; Part Number: 2010-0.75W-0R-200ppm±5%; Tolerance: 5%; Temperature: -55°C~155°C; ComponentLink1Description: DATASHEET; ComponentLink1URL: https://www.lcsc.com/product-detail/Chip-Resistor-Surface-Mount_YAGEO-RC2010JK-070RL_C152156.html; Last changed: 16.07.2024
R147 R148 = 0805-0.125W-100R-100ppm±1%: *; NameFromManufacturer: RC0805FR-07100RL; Manufacturer: Yageo; Place: *); Value: 100R; Tolerance: 1%; Check: False; Case: R0805; Part Number: 0805-0.125W-100R-100ppm±1%; Temperature: -55°C~125°C; ComponentLink1Description: DATASHEET; ComponentLink1URL: https://eu.mouser.com/ProductDetail/YAGEO/RC0805FR-07100RL?qs=8Y8p%252BasKcI6MtXUgG4E6SQ%3D%3D; Datasheet: Datasheets/resistors/PYu-RC_Group_51_RoHS_L_11.pdf; Last changed: 27.10.2022
R149 R150 = 0402-0.0625W-20K-100ppm±1%: Chip Resistor 0402 20kΩ ±1% 50V ±100ppm/℃ Thick Film; NameFromManufacturer: RC0402FR-0720KL; Manufacturer: Yageo; Place: *); Value: 20K; Check: False; Case: R0402; Part Number: 0402-0.0625W-20K-100ppm±1%; Tolerance: 1%; Temperature: -55°C~155°C; ComponentLink1Description: DATASHEET; ComponentLink1URL: https://www.terraelectronica.ru/product/506449; Datasheet: Datasheets/resistors/PYu-RC_Group_51_RoHS_L_11.pdf; Last changed: 27.10.2022
R151 R152 = 0402-0.0625W-2.2K-100ppm±5%: *; NameFromManufacturer: RC0402JR-072K2L; Manufacturer: Yageo; Place: *); Value: 2.2K; Tolerance: 5%; Check: False; Case: R0402; Part Number: 0402-0.0625W-2.2K-100ppm±5%; Temperature: -55°C~155°C; ComponentLink1Description: DATASHEET; ComponentLink1URL: https://octopart.com/ac0402jr-072k2l-yageo-23514430?r=sp; Datasheet: Datasheets/resistors/PYu-AC_51_RoHS_L_8.pdf; Last changed: 27.10.2022
R153 R154 = 0402-0.0625W-100K-100ppm±5%: NameFromManufacturer: RC0402JR-07100KL; Manufacturer: Yageo; Place: *); Value: 100K; Tolerance: 5%; Check: False; Case: R0402; Part Number: 0402-0.0625W-100K-100ppm±5%; Temperature: -55°C~155°C; ComponentLink1Description: DATASHEET; ComponentLink1URL: https://ru.mouser.com/ProductDetail/YAGEO/RC0402JR-07100KL?qs=%2Fha2pyFadugNN0LzwXn2qCsICuw6vgLBeLL%252BmXUKy2OLGS9kgqrNBA%3D%3D; Datasheet: Datasheets/resistors/PYu-RC_Group_51_RoHS_L_11.pdf; Last changed: 27.10.2022
R492 = 1206-0.25W-1M-100ppm±1%: Chip Resistor 1206 1MΩ ±1% 200V ±100ppm/℃ Thick Film; NameFromManufacturer: RC1206FR-071ML; Manufacturer: Yageo; Place: *); Value: 1M; Check: False; Case: R1206; Part Number: 1206-0.25W-1M-100ppm±1%; Tolerance: 1%; Temperature: -55°C~155°C; ComponentLink1Description: DATASHEET; ComponentLink1URL: https://www.lcsc.com/product-detail/Chip-Resistor-Surface-Mount_YAGEO-RC1206FR-071ML_C108083.html?s_z=n_RC1206FR-071ML; Last changed: 09.04.2025
RV1 RV2 = B72214S2321K101: Varistor; Manufacturer: Epcos; Place: *); Voltage: 320V; Check: False; Case: CASE; Part Number: B72214S0600K101; Value: B72214S0600K101; Temperature: -40°C~105°C; ComponentLink1Description: DATASHEET; NameFromManufacturer: B72214S0600K101; ComponentLink1URL: https://www.chipdip.ru/product0/8003145013; Last changed: 27.10.2022
VD33-VD35 VD40 VD41 = B360BQ-13-F: Schottky Rectifier; Manufacturer: Yangjie (YJ); Place: S; Check: False; Part Number: SS56B; Value: SS56B; Temperature: -55°C~150°C; NameFromManufacturer: SS56B; Last changed: 27.10.2022
VD36 VD37 = LM4040D25: 600mA 1 Independent 40V 1V@40mA 200mA SOT-23 Single Diodes RoHS; Manufacturer: Diodes Incorporated; Place: *); Check: False; Part Number: BAS40-7-F; Value: BAS40-7-F; Temperature: -40°C~150°C; ComponentLink1Description: DATASHEET; NameFromManufacturer: BAS40-7-F; ComponentLink1URL: https://www.lcsc.com/product-detail/Voltage-Reference_Diodes-Incorporated-LM4040D25FTA_C107244.html; Last changed: 05.07.2024
VD38 VD39 = SS16T3G: Schottky Power Rectifier; Manufacturer: ON Semiconductor; Place: *); Check: False; Part Number: SS16T3G; Value: SS16T3G; Temperature: -55°C~150°C; ComponentLink1Description: DATASHEET; NameFromManufacturer: SS16T3G; ComponentLink1URL: https://www.onsemi.com/pdf/datasheet/ss16-d.pdf; Datasheet: Datasheets/diodes/SS16-D.PDF; Last changed: 07.12.2022
VT12 VT13 = AON7262E: 60V 6.2mΩ@10V,20A 2.2V@250uA N Channel DFN-8(3.3x3.3) MOSFET; Manufacturer: Alpha & Omega; Check: False; Part Number: AON7262E; NameFromManufacturer: AON7262E; Value: AON7262E
VT14 = WM02P41M: Small signal mosfet; Manufacturer: Wayon; Place: S; Voltage: -20V; Check: False; Part Number: WM02P41M; Value: WM02P41M; Temperature: -55°C~150°C; ComponentLink1Description: DATASHEET; NameFromManufacturer: WM02P41M; ComponentLink1URL: https://www.terraelectronica.ru/product/5031341; Datasheet: Datasheets/transistors/UM6K34NTCN.pdf; Last changeв: 27.10.2022
VT15 = AP50P20Q: 20V 50A 40W 6.6mΩ@4.5V,15A 650mV@250uA P Channel WDFN-8(3x3) MOSFETs; Manufacturer: ALLPOWER; Check: False; Part Number: AP50P20Q; Value: AP50P20Q; NameFromManufacturer: AP50P20Q
VT16 VT17 = MMBT3904: NPN transistor; Manufacturer: Diotec Semiconductor; Place: S; Voltage: 40V; Check: False; Part Number: MMBT3904; Value: MMBT3904; Temperature: -55°C~150°C; ComponentLink1Description: DATASHEET; NameFromManufacturer: MMBT3904; ComponentLink1URL: https://www.terraelectronica.ru/product/607582; Datasheet: Datasheets/transistors/mmbt3904.pdf; Last changeв: 27.10.2022
X13 X14 = 15EDGRM-3.81-02P: Разъемный клеммный блок на плату, 2 контакта. Серия 15EDGRM-3.81; Manufacturer: DEGSON; Check: False; Part Number: 15EDGRM-3.81-02P; Value: 15EDGRM-3.81-02P; NameFromManufacturer: 15EDGRM-3.81-02P
X15 = 3113-110T: PCI Connector, Vertical, Surface Mount, x1, 36 Positions, 1.00mm (0.039in) Pitch; Manufacturer: UMAX; Check: False; Part Number: 3113-110T; Value: 3113-110T; NameFromManufacturer: 3113-110T
X33 = DS1069-4MVW6X: 1 XH 4P -25℃~+85℃ 2.5mm 3A 250V 1x4P Through Hole,P=2.5mm Headers, Male Pins RoHS; Manufacturer: CONNFLY; Check: False; Part Number: DS1069-4MVW6X; Value: DS1069-4MVW6X; NameFromManufacturer: DS1069-4MVW6X
X38 = DC-036A-2.5A-2.5: DC Power Connector Bend-in, -20℃~+70℃, 2.5mm 6mm, 2.5A 24V; Manufacturer: XKB Connection; Place: *); Check: False; Part Number: DC-036A-2.5A-2.5; Value: DC-036A-2.5A-2.5; Temperature: -20°C~70°C; ComponentLink1Description: DATASHEET; NameFromManufacturer: DC-036A-2.5A-2.5; ComponentLink1URL: https://www.lcsc.com/product-detail/dc-power-connectors_xkb-connection-dc-036a-2-5a-2-5_C500106.html; Last changed: 4/8/2025

## Sheet PWR_MAIN.SchDoc
size 420 x 297 mm; Scale: 1:1; DocumentType: Схема электрическая принципиальная; SheetNumber: 5; SheetTotal: 32; DocumentTypeShort: Э3; DocumentInvertoryNumber: ㅤ
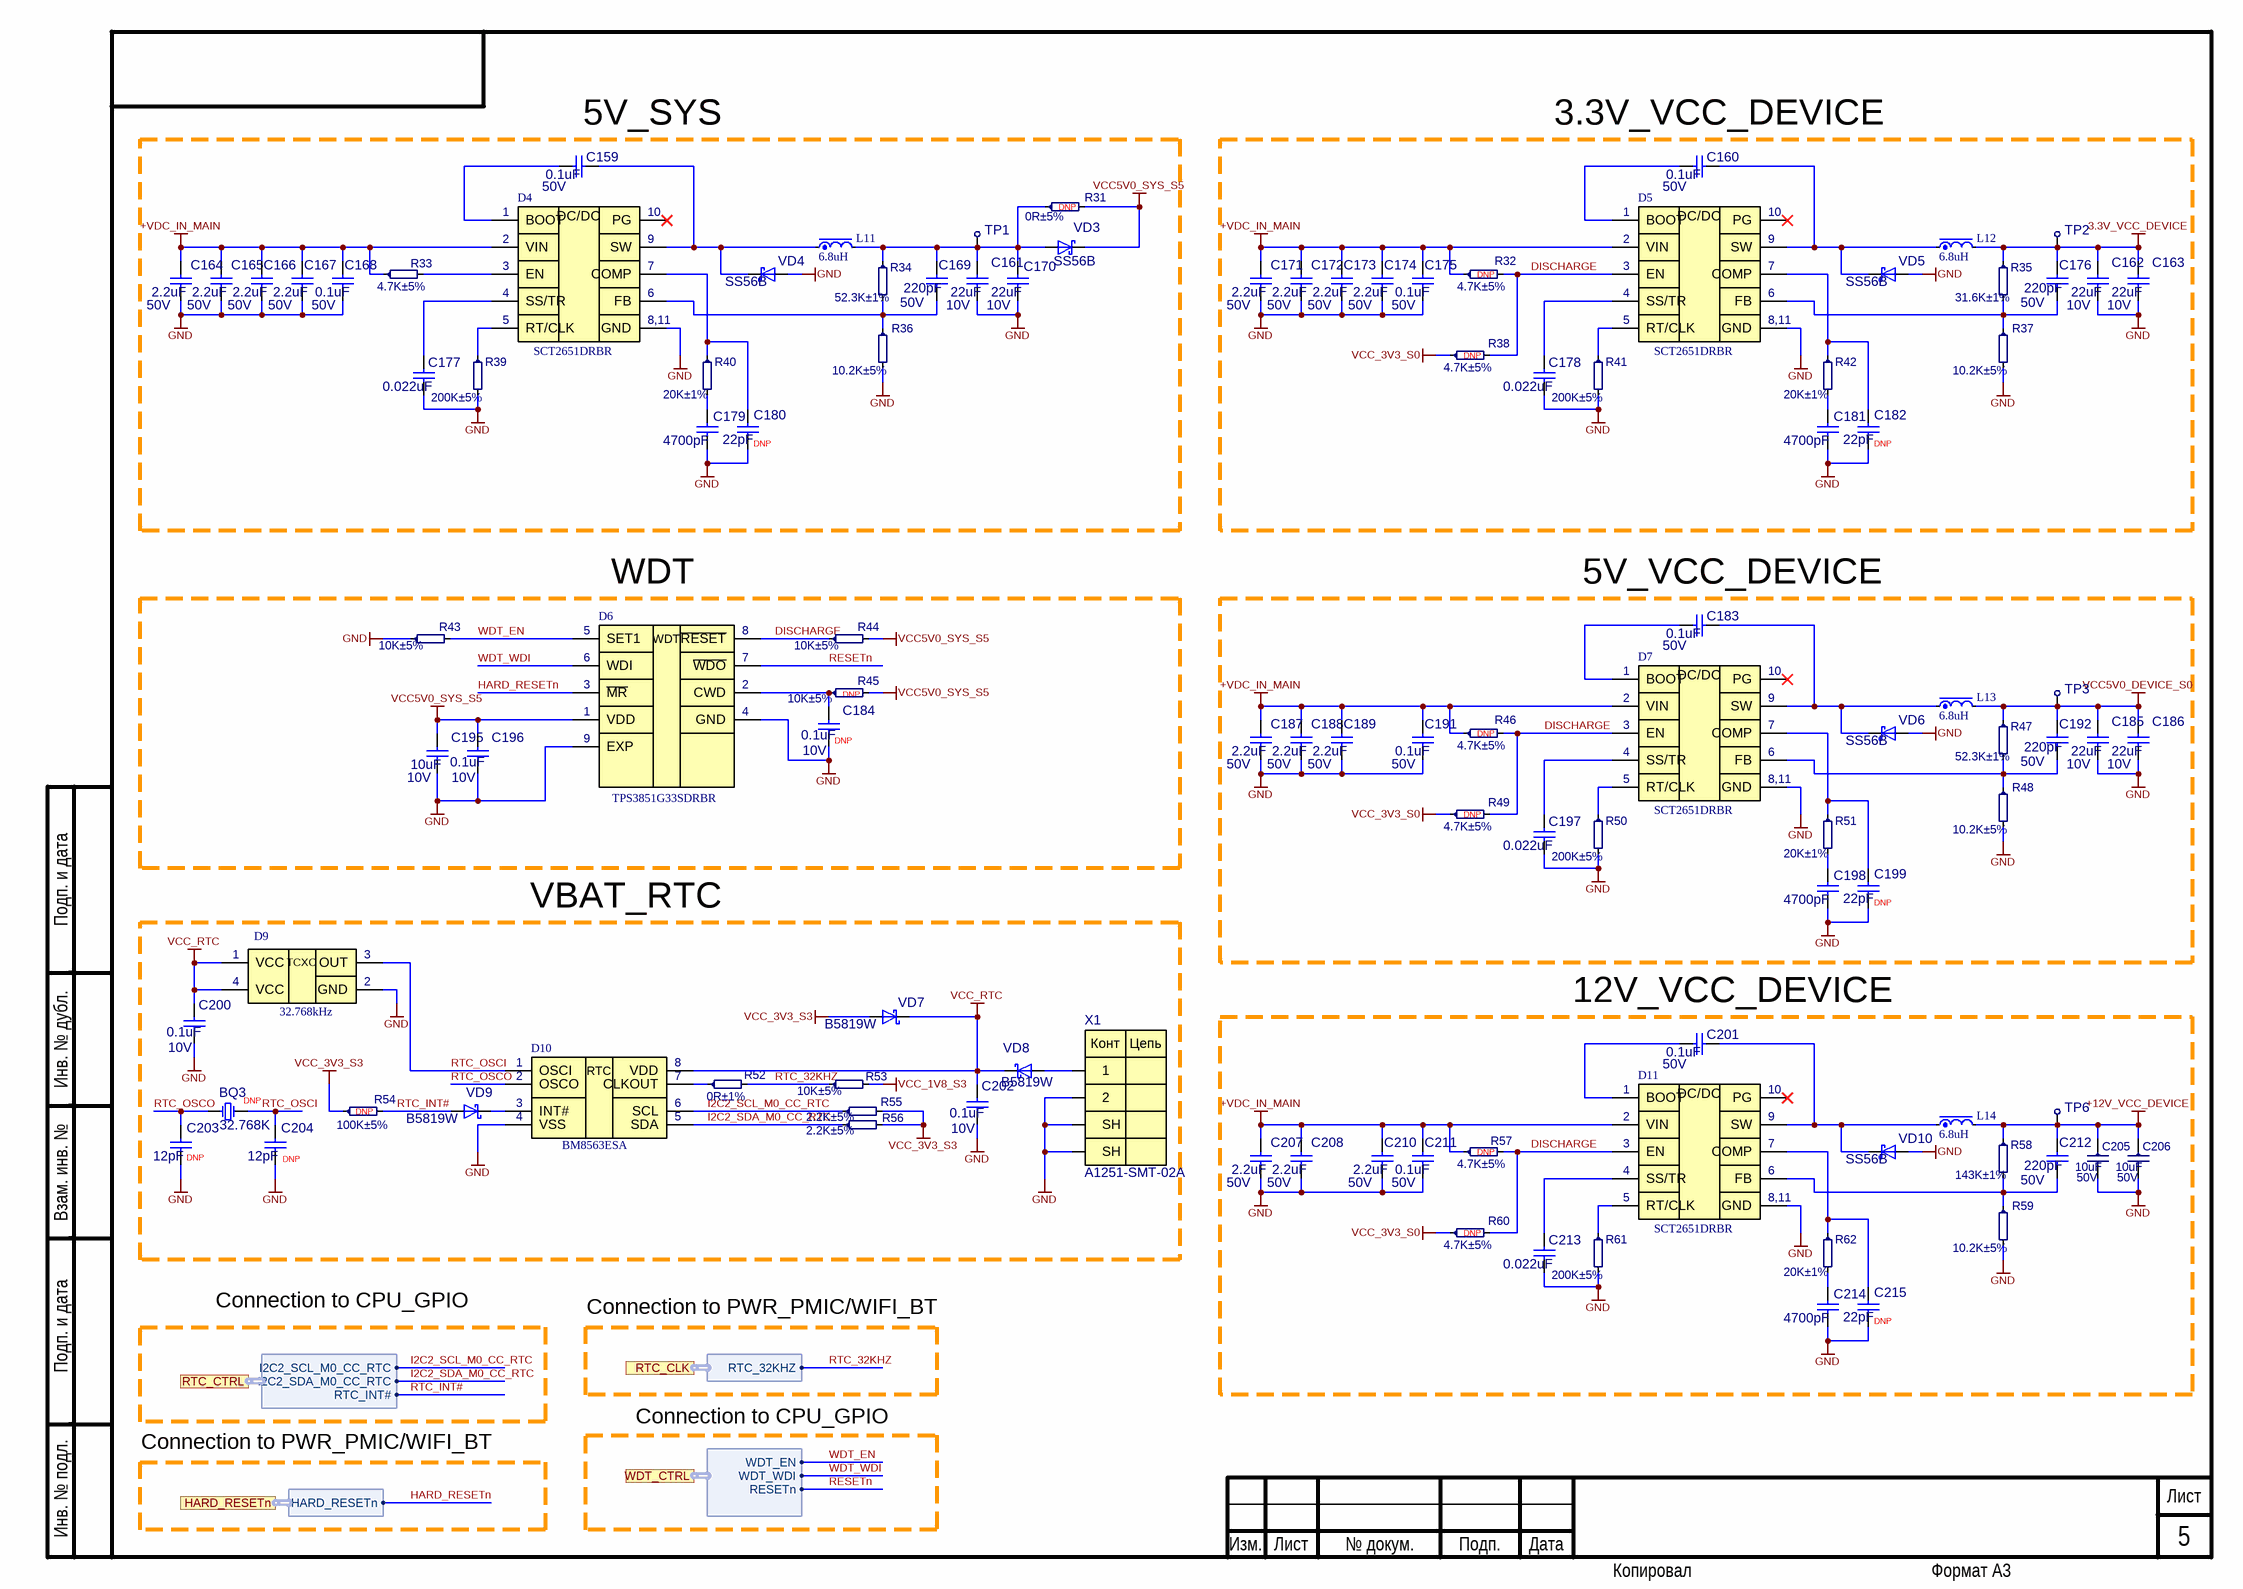
[diagram p3: PWR_MAIN.SchDoc]

### Parts
BQ3  32.768K  [NX3215SA]
C159  0.1uF  Voltage: 50V  [C0402]
C160  0.1uF  Voltage: 50V  [C0402]
C161  22uF  Voltage: 10V  [C0603]
C162  22uF  Voltage: 10V  [C0603]
C163  22uF  Voltage: 10V  [C0603]
C164  2.2uF  Voltage: 50V  [C0805]
C165  2.2uF  Voltage: 50V  [C0805]
C166  2.2uF  Voltage: 50V  [C0805]
C167  2.2uF  Voltage: 50V  [C0805]
C168  0.1uF  Voltage: 50V  [C0402]
C169  220pF  Voltage: 50V  [C0402]
C170  22uF  Voltage: 10V  [C0603]
C171  2.2uF  Voltage: 50V  [C0805]
C172  2.2uF  Voltage: 50V  [C0805]
C173  2.2uF  Voltage: 50V  [C0805]
C174  2.2uF  Voltage: 50V  [C0805]
C175  0.1uF  Voltage: 50V  [C0402]
C176  220pF  Voltage: 50V  [C0402]
C177  0.022uF  [C0402]
C178  0.022uF  [C0402]
C179  4700pF  [C0402]
C180  22pF  [C0402]
C181  4700pF  [C0402]
C182  22pF  [C0402]
C183  0.1uF  Voltage: 50V  [C0402]
C184  0.1uF  Voltage: 10V  [C0402]
C185  22uF  Voltage: 10V  [C0603]
C186  22uF  Voltage: 10V  [C0603]
C187  2.2uF  Voltage: 50V  [C0805]
C188  2.2uF  Voltage: 50V  [C0805]
C189  2.2uF  Voltage: 50V  [C0805]
C191  0.1uF  Voltage: 50V  [C0402]
C192  220pF  Voltage: 50V  [C0402]
C195  10uF  Voltage: 10V  [C0402]
C196  0.1uF  Voltage: 10V  [C0402]
C197  0.022uF  [C0402]
C198  4700pF  [C0402]
C199  22pF  [C0402]
C200  0.1uF  Voltage: 10V  [C0402]
C201  0.1uF  Voltage: 50V  [C0402]
C202  0.1uF  Voltage: 10V  [C0402]
C203  12pF  [C0402]
C204  12pF  [C0402]
C205  10uF  Voltage: 50V  [C1206]
C206  10uF  Voltage: 50V  [C1206]
C207  2.2uF  Voltage: 50V  [C0805]
C208  2.2uF  Voltage: 50V  [C0805]
C210  2.2uF  Voltage: 50V  [C0805]
C211  0.1uF  Voltage: 50V  [C0402]
C212  220pF  Voltage: 50V  [C0402]
C213  0.022uF  [C0402]
C214  4700pF  [C0402]
C215  22pF  [C0402]
D4  SCT2651DRBR  [SCT2651DRBR]
D5  SCT2651DRBR  [SCT2651DRBR]
D6  TPS3851G33SDRBR  [TPS3851G33SDRBR]
D7  SCT2651DRBR  [SCT2651DRBR]
D9  32.768kHz  [1XZA032768AD19]
D10  BM8563ESA  [BM8563ESA]
D11  SCT2651DRBR  [SCT2651DRBR]
L11  6.8uH  [MWSA0603S-6R8MT]
L12  6.8uH  [MWSA0603S-6R8MT]
L13  6.8uH  [MWSA0603S-6R8MT]
L14  6.8uH  [MWSA0603S-6R8MT]
R31  0R±5%  [R2010]
R32  4.7K±5%  [R0402]
R33  4.7K±5%  [R0402]
R34  52.3K±1%  [R0402]
R35  31.6K±1%  [R0402]
R36  10.2K±5%  [R0402]
R37  10.2K±5%  [R0402]
R38  4.7K±5%  [R0402]
R39  200K±5%  [R0402]
R40  20K±1%  [R0402]
R41  200K±5%  [R0402]
R42  20K±1%  [R0402]
R43  10K±5%  [R0402]
R44  10K±5%  [R0402]
R45  10K±5%  [R0402]
R46  4.7K±5%  [R0402]
R47  52.3K±1%  [R0402]
R48  10.2K±5%  [R0402]
R49  4.7K±5%  [R0402]
R50  200K±5%  [R0402]
R51  20K±1%  [R0402]
R52  0R±1%  [R0402]
R53  10K±5%  [R0402]
R54  100K±5%  [R0402]
R55  2.2K±5%  [R0402]
R56  2.2K±5%  [R0402]
R57  4.7K±5%  [R0402]
R58  143K±1%  [R0402]
R59  10.2K±5%  [R0402]
R60  4.7K±5%  [R0402]
R61  200K±5%  [R0402]
R62  20K±1%  [R0402]
TP1  Тестовая точка  [TEST]  (value not drawn)  (no BOM)
TP2  Тестовая точка  [TEST]  (value not drawn)  (no BOM)
TP3  Тестовая точка  [TEST]  (value not drawn)  (no BOM)
TP6  Тестовая точка  [TEST]  (value not drawn)  (no BOM)
VD3  SS56B  [DO-214AA]
VD4  SS56B  [DO-214AA]
VD5  SS56B  [DO-214AA]
VD6  SS56B  [DO-214AA]
VD7  B5819W  [B5819W]
VD8  B5819W  [B5819W]
VD9  B5819W  [B5819W]
VD10  SS56B  [DO-214AA]
X1  A1251-SMT-02A  [A1251-SMT-02A]

### Ports
HARD_RESETn (harness HARD_RESETn), RTC_CLK (harness RTC_CLK), RTC_CTRL (harness RTC_CTRL), WDT_CTRL (harness WDT_CTRL)

### Harnesses
RTC_CLK: RTC_32KHZ
RTC_CTRL: I2C2_SCL_M0_CC_RTC, I2C2_SDA_M0_CC_RTC, RTC_INT#
WDT_CTRL: WDT_WDI, WDT_EN, RESETn
HARD_RESETn: HARD_RESETn

### Nets
3.3V_VCC_DEVICE: C162.2 C163.2 C176.2 L12.2 R35.1 TP2.1
+12V_VCC_DEVICE: C205.1 C206.1 C212.2 L14.2 R58.1 TP6.1
+VDC_IN_MAIN: C164.2 C165.2 C166.2 C167.2 C168.2 C171.2 C172.2 C173.2 C174.2 C175.2 C187.2 C188.2 C189.2 C191.2 C207.2 C208.2 C210.2 C211.2 D4.2(VIN) D5.2(VIN) D7.2(VIN) D11.2(VIN) R32.1 R33.1 R46.1 R57.1
GND: C161.1 C162.1 C163.1 C164.1 C165.1 C166.1 C167.1 C168.1 C170.1 C171.1 C172.1 C173.1 C174.1 C175.1 C177.1 C178.1 C179.1 C180.1 C181.1 C182.1 C184.1 C185.1 C186.1 C187.1 C188.1 C189.1 C191.1 C195.1 C196.1 C197.1 C198.1 C199.1 C200.1 C202.1 C203.1 C204.1 C205.2 C206.2 C207.1 C208.1 C210.1 C211.1 C213.1 C214.1 C215.1 D4.8,11(GND) D5.8,11(GND) D6.4(GND) D6.9(EXP) D7.8,11(GND) D9.2(GND) D10.4(VSS) D11.8,11(GND) R36.2 R37.2 R39.2 R41.2 R43.1 R48.2 R50.2 R59.2 R61.2 VD4.2(A) VD5.2(A) VD6.2(A) VD10.2(A) X1.2 X1.3(SH) X1.4(SH)
VCC5V0_DEVICE_S0: C185.2 C186.2 C192.2 L13.2 R47.1 TP3.1
VCC5V0_SYS_S5: C195.2 C196.2 D6.1(VDD) R31.2 R44.2 R45.2 VD3.1(K)
VCC_1V8_S3: R53.2
VCC_3V3_S0: R38.1 R49.1 R60.1
VCC_3V3_S3: R54.1 R55.2 R56.2 VD7.2(A)
VCC_RTC: C200.2 C202.2 D9.1(VCC) D9.4(VCC) D10.8(VDD) VD7.1(K) VD8.1(K)
DISCHARGE: D5.3(EN) D6.8(~{RESET}) D7.3(EN) D11.3(EN) R32.2 R38.2 R44.1 R46.2 R49.2 R57.2 R60.2
HARD_RESETn: D6.3(~{MR}) ; port HARD_RESETn.HARD_RESETn
I2C2_SCL_M0_CC_RTC: D10.6(SCL) R55.1 ; port RTC_CTRL.I2C2_SCL_M0_CC_RTC
I2C2_SDA_M0_CC_RTC: D10.5(SDA) R56.1 ; port RTC_CTRL.I2C2_SDA_M0_CC_RTC
RESETn: D6.7(~{WDO}) ; port WDT_CTRL.RESETn  [project net PMIC_CTRL.RESETn]
RTC_32KHZ: R52.2 R53.1 ; port RTC_CLK.RTC_32KHZ
RTC_INT#: R54.2 VD9.2(A) ; port RTC_CTRL.RTC_INT#  [project net RTC_CTRL.RTC_INT#]
RTC_OSCI: BQ3.2(out) C204.2 D9.3(OUT) D10.1(OSCI)
RTC_OSCO: BQ3.1(inp) C203.2 D10.2(OSCO)
WDT_EN: D6.5(SET1) R43.2 ; port WDT_CTRL.WDT_EN  [project net WDT_CTRL.WDT_EN]
WDT_WDI: D6.6(WDI) ; port WDT_CTRL.WDT_WDI  [project net WDT_CTRL.WDT_WDI]
NetC159_1: C159.1 D4.9(SW) L11.1 VD4.1(K)
NetC159_2: C159.2 D4.1(BOOT)
NetC160_1: C160.1 D5.9(SW) L12.1 VD5.1(K)
NetC160_2: C160.2 D5.1(BOOT)
NetC161_2: C161.2 C169.2 C170.2 L11.2 R31.1 R34.1 TP1.1 VD3.2(A)
NetC169_1: C169.1 D4.6(FB) R34.2 R36.1
NetC176_1: C176.1 D5.6(FB) R35.2 R37.1
NetC177_2: C177.2 D4.4(SS/TR)
NetC178_2: C178.2 D5.4(SS/TR)
NetC179_2: C179.2 R40.2
NetC180_2: C180.2 D4.7(COMP) R40.1
NetC181_2: C181.2 R42.2
NetC182_2: C182.2 D5.7(COMP) R42.1
NetC183_1: C183.1 D7.9(SW) L13.1 VD6.1(K)
NetC183_2: C183.2 D7.1(BOOT)
NetC184_2: C184.2 D6.2(CWD) R45.1
NetC192_1: C192.1 D7.6(FB) R47.2 R48.1
NetC197_2: C197.2 D7.4(SS/TR)
NetC198_2: C198.2 R51.2
NetC199_2: C199.2 D7.7(COMP) R51.1
NetC201_1: C201.1 D11.9(SW) L14.1 VD10.1(K)
NetC201_2: C201.2 D11.1(BOOT)
NetC212_1: C212.1 D11.6(FB) R58.2 R59.1
NetC213_2: C213.2 D11.4(SS/TR)
NetC214_2: C214.2 R62.2
NetC215_2: C215.2 D11.7(COMP) R62.1
NetD4_3: D4.3(EN) R33.2
NetD4_5: D4.5(RT/CLK) R39.1
NetD5_5: D5.5(RT/CLK) R41.1
NetD7_5: D7.5(RT/CLK) R50.1
NetD10_3: D10.3(INT#) VD9.1(K)
NetD10_7: D10.7(CLKOUT) R52.1
NetD11_5: D11.5(RT/CLK) R61.1
NetVD8_2: VD8.2(A) X1.1

Not connected (* = marked no-connect by the designer): D4 10(PG)*; D5 10(PG)*; D7 10(PG)*; D11 10(PG)*

### Notes on the sheet
- (near C159) 5V_SYS
- (near C160) 3.3V_VCC_DEVICE
- (near R31) DNP
- (near R32) DNP
- (near R38) DNP
- (near C180) DNP
- (near C182) DNP
- (near D6) WDT
- (near C183) 5V_VCC_DEVICE
- (near R45) DNP
- (near R46) DNP
- (near C184) DNP
- (near R49) DNP
- VBAT_RTC
- (near C199) DNP
- (near C201) 12V_VCC_DEVICE
- (near BQ3) DNP
- (near R54) DNP
- (near C203) DNP
- (near C204) DNP
- (near R57) DNP
- (near R60) DNP
- Connection to CPU_GPIO
- Connection to PWR_PMIC/WIFI_BT
- (near C215) DNP
- Подп. и дата
- Инв. № дубл.
- Взам. инв. №
- Инв. № подл.
- Изм.
- Лист
- № докум.
- Подп.
- Дата
- Копировал
- Формат А3
- (in symbol 1XZA032768AD19) TCXO
- (in symbol A1251-SMT-02A) Конт; Цепь
- (in symbol BM8563ESA) RTC
- (in symbol SCT2651DRBR) DC/DC
- (in symbol TPS3851G33SDRBR) WDT

### Library data of the parts
BQ3 = SJK-7L-32.768-12.5-20-70-C: *; Manufacturer: SJK; Place: S; Tolerance: 3ppm; Check: False; Part Number: SJK-7L-32.768-12.5-20-70-C; Value: 32.768K; Temperature: -40°C~85°C; NameFromManufacturer: SJK-7L-32.768-12.5-20-70-C; ComponentLink1Description: DATASHEET; ComponentLink1URL: https://roboparts.ru/upload/iblock/095/095a21a3f536a48ddbbe95c19b949316.pdf; Datasheet: Datasheets/quartz/095a21a3f536a48ddbbe95c19b949316.pdf; Last changed: 27.10.2022
C159 C160 C168 C175 C183 C191 C201 C211 = 0402-X5R-50V-0.1uF±10%: Manufacturer: Yageo; NameFromManufacturer: CC0402KRX5R9BB104; Place: S; Tolerance: 10%; Check: False; Part Number: 0402-X5R-50V-0.1uF±10%; Value: 0.1uF; Temperature: -55°C~85°C; ComponentLink2Description: Link to datasheet; ComponentLink1Description: DATASHEET; ComponentLink2URL: https://www.yageo.com/upload/media/product/productsearch/datasheet/mlcc/UPY-GPHC_X5R_4V-to-50V_26.pdf; ComponentLink1URL: Datasheets/capacitors/UPY-GPHC_X5R_4V-to-50V_26.pdf; Last changed: 27.10.2022
C161-C163 C170 C185 C186 = 0603-X5R-10V-22uF±20%: *; Manufacturer: Murata; NameFromManufacturer: GRM188R61A226ME15D; Place: S; Tolerance: 20%; Part Number: 0603-X5R-10V-22uF±20%; Value: 22uF; Temperature: -55°C~85°C; ComponentLink2Description: Link to datasheet; ComponentLink1Description: DATASHEET
C164-C167 C171-C174 C187-C189 C207 C208 C210 = 0805-X7R-50V-2.2uF±10%: Manufacturer: Yageo; NameFromManufacturer: CC0805KKX7R9BB225; Place: S; Tolerance: 10%; Check: False; Part Number: 0805-X7R-50V-2.2uF±10%; Value: 2.2uF; Temperature: -55°C~125°C; ComponentLink2Description: Link to datasheet; ComponentLink1Description: DATASHEET; ComponentLink2URL: https://www.yageo.com/upload/media/product/productsearch/datasheet/mlcc/UPY-GPHC_X7R_6.3V-to-50V_18.pdf; ComponentLink1URL: Datasheets/capacitors/UPY-GPHC_X7R_6.3V-to-50V_18.pdf; Last changed: 27.10.2022
C169 C176 C192 C212 = 0402-NP0-50V-220pF±5%: *; Manufacturer: Yageo; NameFromManufacturer: CC0402JRNPO9BN221; Place: S; Tolerance: 5%; Check: False; Part Number: 0402-NP0-50V-220pF±5%; Value: 220pF; Temperature: -55°C~125°C; ComponentLink2Description: Link to datasheet; ComponentLink1Description: DATASHEET; ComponentLink2URL: https://octopart.com/cc0402jrnpo9bn221-yageo-42335946?r=sp#Specs; ComponentLink1URL: Datasheets/capacitors/MV.pdf; Last changed: 27.10.2022
C177 C178 C197 C213 = 0402-X7R-50V-0.022uF±10%: Manufacturer: Murata Electronics; NameFromManufacturer: GRM155R71H223KA12D; Place: S; Voltage: 50V; Tolerance: 10%; Check: False; Part Number: 0402-X7R-50V-0.022uF±10%; Value: 0.022uF; Temperature: -55°C~125°C; ComponentLink2Description: Link to datasheet; ComponentLink1Description: DATASHEET; ComponentLink2URL: https://www.terraelectronica.ru/product/866781; ComponentLink1URL: Datasheets/capacitors/GRM155R71H223KA12#.pdf; Last changed: 27.10.2022
C179 C181 C198 C214 = 0402-X7R-50V-4700pF±10%: *; Manufacturer: Yageo; NameFromManufacturer: CC0402KRX7R9BB472; Place: S; Voltage: 50V; Tolerance: 10%; Check: False; Part Number: 0402-X7R-50V-4700pF±10%; Value: 4700pF; Temperature: -55°C~125°C; ComponentLink2Description: Link to datasheet; ComponentLink1Description: DATASHEET; ComponentLink2URL: https://octopart.com/cc0402krx7r9bb472-yageo-9288149?r=sp; ComponentLink1URL: Datasheets/capacitors/UPY-GPHC_X7R_6.3V-to-50V_20.pdf; Last changed: 27.10.2022
C180 C182 C199 C215 = 0402-NP0-50V-22pF ±10%: Manufacturer: Samsung; NameFromManufacturer: CL05C220JB51PNC; Place: S; Voltage: 50V; Tolerance: 10%; Check: False; Part Number: 0402-NP0-50V-22pF ±10%; Value: 22pF; Temperature: -55°C~125°C; ComponentLink2Description: Link to datasheet; ComponentLink1Description: DATASHEET; ComponentLink2URL: https://ru.mouser.com/datasheet/2/585/MLCC-1837944.pdf; ComponentLink1URL: Datasheets/capacitors/CL05C220JB51PNC_Spec.pdf; Last changed: 27.10.2022
C184 C196 C200 C202 = 0402-X7R-16V-0.1uF±10%: Part Number: 0402-X5R-10V-0.1uF±10%; Manufacturer: Yageo; NameFromManufacturer: CC0402KRX5R6BB104; Place: S; Tolerance: 10%; Check: False; Value: 0.1uF; Temperature: -55°C~125°C; ComponentLink2Description: Link to datasheet; ComponentLink1Description: DATASHEET; Last changed: 27.10.2022
C195 = 0402-X5R-10V-10uF±20: *; Manufacturer: Samsung; NameFromManufacturer: CL05A106MP5NUNC; Place: S; Tolerance: 20%; Check: False; Part Number: 0402-X5R-10V-10uF±20; Value: 10uF; Temperature: -55°C~85°C; ComponentLink2Description: Link to datasheet; ComponentLink1Description: DATASHEET; Last changed: 06.04.2023
C203 C204 = 0402-NP0-50V-12pF±5%: Manufacturer: Murata Electronics; NameFromManufacturer: GRM1555C1H120JA01D; Place: S; Voltage: 50V; Tolerance: 5%; Check: False; Part Number: 0402-NP0-50V-12pF±5%; Value: 12pF; Temperature: -55°C~125°C; ComponentLink2Description: Link to datasheet; ComponentLink1Description: DATASHEET; ComponentLink2URL: https://www.terraelectronica.ru/pdf/show?pdf_file=http%253A%252F%252Fwww.farnell.com%252Fdatasheets%252F2048662.pdf; ComponentLink1URL: Datasheets/capacitors/GRM1555C1H120JA01-01A.pdf; Last changed: 27.10.2022
C205 C206 = 1206-X5R-50V-010uF±10%: as C284 on sheet PWR_DC_IN; Case: C1206; Part Number: 1206-X5R-50V-010uF±10%; Value: 10uF; Temperature: -55°C~85°C; ComponentLink2Description: Link to datasheet; ComponentLink1Description: DATASHEET; ComponentLink2URL: https://www.terraelectronica.ru/product/2097656; ComponentLink1URL: Datasheets/capacitors/UPY-GPHC_X5R_4V-to-50V_27.pdf; Last changed: 27.10.2022
D4 D5 D7 D11 = SCT2651DRBR: 4.5V-60V Vin,5A, High Efficiency Step-down DCDC Converter with Programmable Frequency; Manufacturer: SCT; Check: False; Part Number: SCT2651DRBR; NameFromManufacturer: SCT2651DRBR; Value: SCT2651DRBR
D6 = TPS3851G33SDRBR: High-accuracy voltage supervisor with Integrated watchdog timer; Manufacturer: Texas Instruments; Check: False; Part Number: TPS3851G33SDRBR; NameFromManufacturer: TPS3851G33SDRBR; Value: TPS3851G33SDRBR
D9 = 1XZA032768AD19: Manufacturer: KDS; Check: False; Part Number: 1XZA032768AD19; NameFromManufacturer: 1XZA032768AD19; Value: 32.768kHz
D10 = BM8563ESA: I2C SOP-8 Real-time Clocks; Manufacturer: GATEMODE; Check: False; Analog: TCS8563 (SOP-8); Part Number: BM8563ESA; NameFromManufacturer: BM8563ESA; Value: BM8563ESA; ComponentLink1Description: DATASHEET; Last changed: 24.03.2023
L11-L14 = MWSA0603S-6R8MT: Fixed Ind 6.8UH 5A; Manufacturer: Sunlord; Check: False; Part Number: MWSA0603S-6R8MT; Value: 6.8uH; NameFromManufacturer: MWSA0603S-6R8MT; Current: 5A
R31 = 2010-0.75W-0R-200ppm±5%: as R145 on sheet PWR_DC_IN; Case: R2010; Part Number: 2010-0.75W-0R-200ppm±5%; Tolerance: 5%; Temperature: -55°C~155°C; ComponentLink1Description: DATASHEET; ComponentLink1URL: https://www.lcsc.com/product-detail/Chip-Resistor-Surface-Mount_YAGEO-RC2010JK-070RL_C152156.html; Last changed: 16.07.2024
R32 R33 R38 R46 R49 R57 R60 = 0402-0.0625W-4.7K-100ppm±5%: NameFromManufacturer: RC0402JR-074K7L; Manufacturer: Yageo; Place: *); Value: 4.7K; Tolerance: 5%; Check: False; Case: R0402; Part Number: 0402-0.0625W-4.7K-100ppm±5%; Temperature: -55°C~155°C; ComponentLink1Description: DATASHEET; ComponentLink1URL: https://ru.mouser.com/ProductDetail/YAGEO/RC0402JR-074K7L?qs=%2Fha2pyFadugNN0LzwXn2qDR0lAGI9qruexMTkPBFwcD9DqmvUvet2g%3D%3D; Datasheet: Datasheets/resistors/PYu-RC_Group_51_RoHS_L_11.pdf; Last changed: 27.10.2022
R34 R47 = 0402-0.0625W-52.3K-100ppm±1%: NameFromManufacturer: RC0402FR-0752K3L; Manufacturer: Yageo; Place: *); Value: 52.3K; Tolerance: 1%; Check: False; Case: R0402; Part Number: 0402-0.0625W-52.3K-100ppm±1%; Temperature: -55°C~155°C; ComponentLink1Description: DATASHEET; ComponentLink1URL: https://www.promelec.ru/product/306095/; Datasheet: Datasheets/resistors/PYu-RC_Group_51_RoHS_L_12.pdf; Last changed: 31.03.2023
R35 = 0402-0.0625W-52.3K-100ppm±1%: Part Number: 0402-0.0625W-31.6K-100ppm±1%; NameFromManufacturer: RC0402FR-0731K6L; Manufacturer: Yageo; Place: *); Value: 31.6K; Tolerance: 1%; Check: False; Case: R0402; Temperature: -55°C~155°C; ComponentLink1Description: DATASHEET; ComponentLink1URL: https://www.promelec.ru/product/306095/; Datasheet: Datasheets/resistors/PYu-RC_Group_51_RoHS_L_12.pdf; Last changed: 31.03.2023
R36 R37 R48 R59 = 0402-0.0625W-10K-100ppm±5%: Part Number: 0402-0.0625W-10.2K-100ppm±5%; NameFromManufacturer: RC0402FR-0710K2L; Manufacturer: Yageo; Place: *); Value: 10.2K; Tolerance: 5%; Check: False; Case: R0402; Temperature: -55°C~155°C; ComponentLink1Description: DATASHEET; ComponentLink1URL: https://ru.mouser.com/ProductDetail/YAGEO/RC0402JR-0710KL?qs=%2Fha2pyFadugNN0LzwXn2qF8HRAp201xOpXu%252BapQnyvRGE%2F%252Bpr1TWjQ%3D%3D; Datasheet: Datasheets/resistors/PYu-RC_Group_51_RoHS_L_11.pdf; Last changed: 27.10.2022
R39 R41 R50 R61 = 0402-0.0625W-200K-100ppm±5%: *; NameFromManufacturer: RC0402JR-07200KL; Manufacturer: Yageo; Place: *); Value: 200K; Tolerance: 5%; Check: False; Case: R0402; Part Number: 0402-0.0625W-200K-100ppm±5%; Temperature: -55°C~125°C; ComponentLink1Description: DATASHEET; ComponentLink1URL: https://ru.mouser.com/datasheet/2/447/PYu_RC_Group_51_RoHS_L_10-1664068.pdf; Datasheet: Datasheets/resistors/PYu_RC_Group_51_RoHS_L_10-1664068.pdf; Last changed: 27.10.2022
R40 R42 R51 R62 = 0402-0.0625W-20K-100ppm±1%: as R149 on sheet PWR_DC_IN; Case: R0402; Part Number: 0402-0.0625W-20K-100ppm±1%; Tolerance: 1%; Temperature: -55°C~155°C; ComponentLink1Description: DATASHEET; ComponentLink1URL: https://www.terraelectronica.ru/product/506449; Datasheet: Datasheets/resistors/PYu-RC_Group_51_RoHS_L_11.pdf; Last changed: 27.10.2022
R43-R45 R53 = 0402-0.0625W-10K-100ppm±5%: NameFromManufacturer: RC0402JR-0710KL; Manufacturer: Yageo; Place: *); Value: 10K; Tolerance: 5%; Check: False; Case: R0402; Part Number: 0402-0.0625W-10K-100ppm±5%; Temperature: -55°C~155°C; ComponentLink1Description: DATASHEET; ComponentLink1URL: https://ru.mouser.com/ProductDetail/YAGEO/RC0402JR-0710KL?qs=%2Fha2pyFadugNN0LzwXn2qF8HRAp201xOpXu%252BapQnyvRGE%2F%252Bpr1TWjQ%3D%3D; Datasheet: Datasheets/resistors/PYu-RC_Group_51_RoHS_L_11.pdf; Last changed: 27.10.2022
R52 = 0402-0.0625W-0R-100ppm±1%: Chip Resistor 0402 0Ω ±1% 50V ±100ppm/℃ Thick Film; NameFromManufacturer: RC0402FR-070RL; Manufacturer: Yageo; Place: *); Value: 0R; Check: False; Case: R0402; Part Number: 0402-0.0625W-0R-100ppm±1%; Tolerance: 1%; Temperature: -55°C~155°C; ComponentLink1Description: DATASHEET; ComponentLink1URL: https://www.chipdip.ru/product0/8000617426?ysclid=l7og5x0plo427794326; Datasheet: Datasheets/resistors/DOC012445956.pdf; Last changed: 27.10.2022
R54 = 0402-0.0625W-100K-100ppm±5%: as R153 on sheet PWR_DC_IN; Case: R0402; Part Number: 0402-0.0625W-100K-100ppm±5%; Temperature: -55°C~155°C; ComponentLink1Description: DATASHEET; ComponentLink1URL: https://ru.mouser.com/ProductDetail/YAGEO/RC0402JR-07100KL?qs=%2Fha2pyFadugNN0LzwXn2qCsICuw6vgLBeLL%252BmXUKy2OLGS9kgqrNBA%3D%3D; Datasheet: Datasheets/resistors/PYu-RC_Group_51_RoHS_L_11.pdf; Last changed: 27.10.2022
R55 R56 = 0402-0.0625W-2.2K-100ppm±5%: as R151 on sheet PWR_DC_IN; Case: R0402; Part Number: 0402-0.0625W-2.2K-100ppm±5%; Temperature: -55°C~155°C; ComponentLink1Description: DATASHEET; ComponentLink1URL: https://octopart.com/ac0402jr-072k2l-yageo-23514430?r=sp; Datasheet: Datasheets/resistors/PYu-AC_51_RoHS_L_8.pdf; Last changed: 27.10.2022
R58 = 0402-0.0625W-52.3K-100ppm±1%: Part Number: 0402-0.0625W-143K-100ppm±1%; NameFromManufacturer: RC0402FR-07143KL; Manufacturer: Yageo; Place: *); Value: 143K; Tolerance: 1%; Check: False; Case: R0402; Temperature: -55°C~155°C; ComponentLink1Description: DATASHEET; ComponentLink1URL: https://www.promelec.ru/product/306095/; Datasheet: Datasheets/resistors/PYu-RC_Group_51_RoHS_L_12.pdf; Last changed: 31.03.2023
TP1-TP3 TP6 = Тестовая точка: *; Check: False; Part Number: Тестовая точка; Value: Тестовая точка; ComponentLink1Description: DATASHEET; Manufacturer: *
VD3-VD6 VD10 = B360BQ-13-F: as VD33 on sheet PWR_DC_IN; Part Number: SS56B; Value: SS56B; Temperature: -55°C~150°C; NameFromManufacturer: SS56B; Last changed: 27.10.2022
VD7-VD9 = B5819W: Manufacturer: MDD; Check: False; Part Number: B5819W; Value: B5819W; NameFromManufacturer: B5819W
X1 = A1251-SMT-02A: PicoBlade 1.25mm; Manufacturer: MOLEX; Check: False; Part Number: A1251-SMT-02A; Value: A1251-SMT-02A; NameFromManufacturer: A1251-SMT-02A